# EAGLE schematic DiscoRap_V11 (EAGLE 6.6.0)

## Sheet 1 of 9
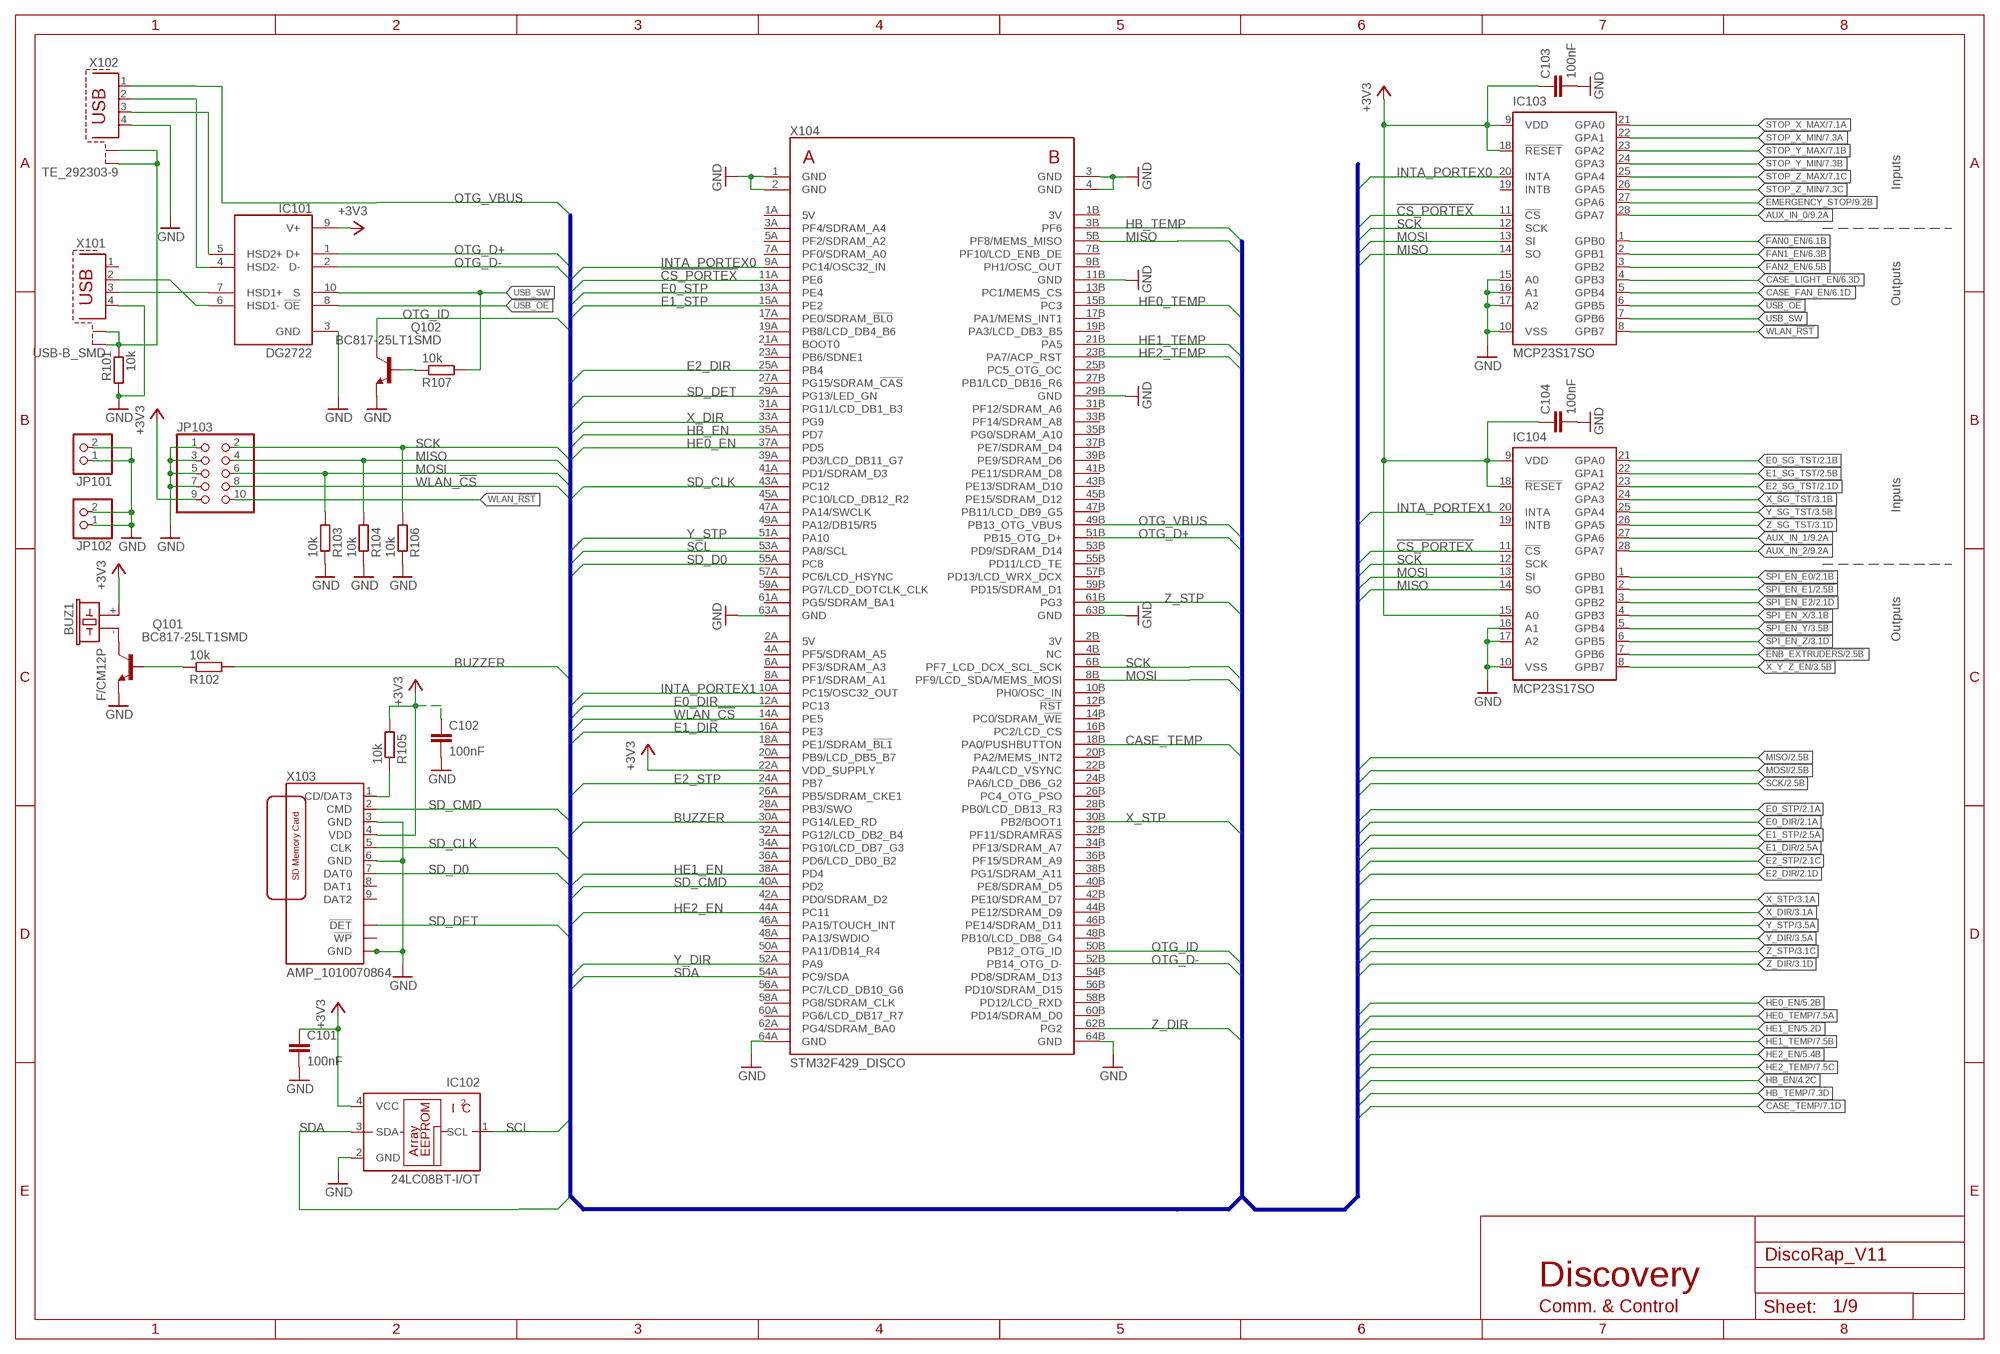
[diagram p0: schematic, sheet 1]

### Parts
BUZ1  F/CM12P  [F/CM12P]
C101  100nF  C-EU0805  [0805]
C102  100nF  C-EU0805  [0805]
C103  100nF  C-EU0805  [0805]
C104  100nF  C-EU0805  [0805]
IC101  DG2722  [MINI_QFN_10L]
IC102  24LC08BT-I/OT  24LC00OT  [SOT23-5L]
IC103  MCP23S17SO  [SO28W]
IC104  MCP23S17SO  [SO28W]
JP101  PINHD-1X2  [1X02]
JP102  PINHD-1X2  [1X02]
JP103  PINHD-2X5  [2X05]
Q101  BC817-25LT1SMD  [SOT23-BEC]
Q102  BC817-25LT1SMD  [SOT23-BEC]
R101  10k  R-EU0805  [0805]
R102  10k  R-EU0805  [0805]
R103  10k  R-EU0805  [0805]
R104  10k  R-EU0805  [0805]
R105  10k  R-EU0805  [0805]
R106  10k  R-EU0805  [0805]
R107  10k  R-EU0805  [0805]
X101  USB-B_SMD  [USB_B_SMD]
X102  TE_292303-9  [TE_USB_A_SMD]
X103  AMP_1010070864  [AMP_1010070864]
X104  STM32F429_DISCO  [STM429_DISCOVERY]

### Nets
!CS_PORTEX: IC103.11(!CS) IC104.11(!CS) X104.11A(PE6)
!ENB_EXTRUDERS: IC104.7(GPB6) ; also sheet 2
!SPI_EN_E0: IC104.1(GPB0) ; also sheet 2
!SPI_EN_E1: IC104.2(GPB1) ; also sheet 2
!SPI_EN_E2: IC104.3(GPB2) ; also sheet 2
!SPI_EN_X: IC104.4(GPB3) ; also sheet 3
!SPI_EN_Y: IC104.5(GPB4) ; also sheet 3
!SPI_EN_Z: IC104.6(GPB5) ; also sheet 3
!USB_OE: IC101.8(!OE) IC103.6(GPB5)
!X_Y_Z_EN: IC104.8(GPB7) ; also sheet 3
+3V3: BUZ1.+ C101.1 C102.1 C103.1 C104.1 IC101.9(V+) IC102.4(VCC) IC103.9(VDD) IC103.18(!RESET) IC104.9(VDD) IC104.15(A0) IC104.18(!RESET) JP103.9 R105.2 X103.4(VDD) X104.22A(VDD_SUPPLY) ; also sheet 2,3,7,8,9
AUX_IN_0: IC103.28(GPA7) ; also sheet 9
AUX_IN_1: IC104.27(GPA6) ; also sheet 9
AUX_IN_2: IC104.28(GPA7) ; also sheet 9
BUZZER: R102.2 X104.30A(PG14/LED_RD)
CASE_FAN_EN: IC103.5(GPB4) ; also sheet 6
CASE_LIGHT_EN: IC103.4(GPB3) ; also sheet 6
CASE_TEMP: X104.18B(PA0/PUSHBUTTON) ; also sheet 7
E0_DIR: X104.12A(PC13) ; also sheet 2
E0_SG_TST: IC104.21(GPA0) ; also sheet 2
E0_STP: X104.13A(PE4) ; also sheet 2
E1_DIR: X104.16A(PE3) ; also sheet 2
E1_SG_TST: IC104.22(GPA1) ; also sheet 2
E1_STP: X104.15A(PE2) ; also sheet 2
E2_DIR: X104.25A(PB4) ; also sheet 2
E2_SG_TST: IC104.23(GPA2) ; also sheet 2
E2_STP: X104.24A(PB7) ; also sheet 2
EMERGENCY_STOP: IC103.27(GPA6) ; also sheet 9
FAN0_EN: IC103.1(GPB0) ; also sheet 6
FAN1_EN: IC103.2(GPB1) ; also sheet 6
FAN2_EN: IC103.3(GPB2) ; also sheet 6
GND: C101.2 C102.2 C103.2 C104.2 IC101.3(GND) IC102.2(GND) IC103.10(VSS) IC103.15(A0) IC103.16(A1) IC103.17(A2) IC104.10(VSS) IC104.16(A1) IC104.17(A2) JP101.1 JP101.2 JP102.1 JP102.2 JP103.1 JP103.3 JP103.5 JP103.7 Q101.E Q102.E R101.2 R103.1 R104.1 R106.1 X101.4 X102.4 X103.3(GND) X103.6(GND) X103.GND1(GND) X103.GND2(GND) X103.GND3(GND) X103.GND4(GND) X104.1(GND) X104.2(GND) X104.3(GND) X104.4(GND) X104.11B(GND) X104.29B(GND) X104.63A(GND) X104.63B(GND) X104.64A(GND) X104.64B(GND) ; also sheet 2,3,4,5,6,7,8,9
HB_EN: X104.35A(PD7) ; also sheet 4
HB_TEMP: X104.3B(PF6) ; also sheet 7
HE0_EN: X104.37A(PD5) ; also sheet 5
HE0_TEMP: X104.15B(PC3) ; also sheet 7
HE1_EN: X104.38A(PD4) ; also sheet 5
HE1_TEMP: X104.21B(PA5) ; also sheet 7
HE2_EN: X104.44A(PC11) ; also sheet 5
HE2_TEMP: X104.23B(PA7/ACP_RST) ; also sheet 7
INTA_PORTEX0: IC103.20(INTA) X104.9A(PC14/OSC32_IN)
INTA_PORTEX1: IC104.20(INTA) X104.10A(PC15/OSC32_OUT)
MISO: IC103.14(SO) IC104.14(SO) JP103.4 R104.2 X104.5B(PF8/MEMS_MISO) ; also sheet 2,3,9
MOSI: IC103.13(SI) IC104.13(SI) JP103.6 R103.2 X104.8B(PF9/LCD_SDA/MEMS_MOSI) ; also sheet 2,3,9
N$1: R105.1 X103.1(CD/DAT3)
N$2: IC101.4(HSD2-) X102.2
N$37: IC101.5(HSD2+) X102.3
N$38: IC101.7(HSD1+) X101.3
N$39: BUZ1.- Q101.C
N$40: IC101.6(HSD1-) X101.2
N$41: R101.1 X101.5(S1) X101.6(S2) X102.5(S1) X102.6(S2)
N$43: Q102.B R107.1
N$89: Q101.B R102.1
OTG_D+: IC101.1(D+) X104.51B(PB15_OTG_D+)
OTG_D-: IC101.2(D-) X104.52B(PB14_OTG_D-)
OTG_ID: Q102.C X104.50B(PB12_OTG_ID)
OTG_VBUS: X102.1 X104.49B(PB13_OTG_VBUS)
SCK: IC103.12(SCK) IC104.12(SCK) JP103.2 R106.2 X104.6B(PF7_LCD_DCX_SCL_SCK) ; also sheet 2,3,9
SCL: IC102.1(SCL) X104.53A(PA8/SCL)
SD_CLK: X103.5(CLK) X104.43A(PC12)
SD_CMD: X103.2(CMD) X104.40A(PD2)
SD_D0: X103.7(DAT0) X104.55A(PC8)
SD_DET: X103.DET(!DET) X104.29A(PG13/LED_GN)
SDA: IC102.3(SDA) X104.54A(PC9/SDA)
STOP_X_MAX: IC103.21(GPA0) ; also sheet 7
STOP_X_MIN: IC103.22(GPA1) ; also sheet 7
STOP_Y_MAX: IC103.23(GPA2) ; also sheet 7
STOP_Y_MIN: IC103.24(GPA3) ; also sheet 7
STOP_Z_MAX: IC103.25(GPA4) ; also sheet 7
STOP_Z_MIN: IC103.26(GPA5) ; also sheet 7
USB_SW: IC101.10(S) IC103.7(GPB6) R107.2
WLAN_!CS: JP103.8 X104.14A(PE5)
WLAN_!RST: IC103.8(GPB7) JP103.10
X_DIR: X104.33A(PG9) ; also sheet 3
X_SG_TST: IC104.24(GPA3) ; also sheet 3
X_STP: X104.30B(PB2/BOOT1) ; also sheet 3
Y_DIR: X104.52A(PA9) ; also sheet 3
Y_SG_TST: IC104.25(GPA4) ; also sheet 3
Y_STP: X104.51A(PA10) ; also sheet 3
Z_DIR: X104.62B(PG2) ; also sheet 3
Z_SG_TST: IC104.26(GPA5) ; also sheet 3
Z_STP: X104.61B(PG3) ; also sheet 3
Unconnected: IC103.19(INTB) IC104.19(INTB) X101.1 X103.8(DAT1) X103.9(DAT2) X103.WP(!WP) X104.1A(5V) X104.1B(3V) X104.2A(5V) X104.2B(3V) X104.3A(PF4/SDRAM_A4) X104.4A(PF5/SDRAM_A5) X104.4B(NC) X104.5A(PF2/SDRAM_A2) X104.6A(PF3/SDRAM_A3) X104.7A(PF0/SDRAM_A0) X104.7B(PF10/LCD_ENB_DE) X104.8A(PF1/SDRAM_A1) X104.9B(PH1/OSC_OUT) X104.10B(PH0/OSC_IN) X104.12B(!RST) X104.13B(PC1/MEMS_CS) X104.14B(PC0/SDRAM_!WE) X104.16B(PC2/LCD_CS) X104.17A(PE0/SDRAM_!BL0) X104.17B(PA1/MEMS_INT1) X104.18A(PE1/SDRAM_!BL1) X104.19A(PB8/LCD_DB4_B6) X104.19B(PA3/LCD_DB3_B5) X104.20A(PB9/LCD_DB5_B7) X104.20B(PA2/MEMS_INT2) X104.21A(BOOT0) X104.22B(PA4/LCD_VSYNC) X104.23A(PB6/SDNE1) X104.24B(PA6/LCD_DB6_G2) X104.25B(PC5_OTG_OC) X104.26A(PB5/SDRAM_CKE1) X104.26B(PC4_OTG_PSO) X104.27A(PG15/SDRAM_!CAS) X104.27B(PB1/LCD_DB16_R6) X104.28A(PB3/SWO) X104.28B(PB0/LCD_DB13_R3) X104.31A(PG11/LCD_DB1_B3) X104.31B(PF12/SDRAM_A6) X104.32A(PG12/LCD_DB2_B4) X104.32B(PF11/SDRAM!RAS) X104.33B(PF14/SDRAM_A8) X104.34A(PG10/LCD_DB7_G3) X104.34B(PF13/SDRAM_A7) X104.35B(PG0/SDRAM_A10) X104.36A(PD6/LCD_DB0_B2) X104.36B(PF15/SDRAM_A9) X104.37B(PE7/SDRAM_D4) X104.38B(PG1/SDRAM_A11) X104.39A(PD3/LCD_DB11_G7) X104.39B(PE9/SDRAM_D6) X104.40B(PE8/SDRAM_D5) X104.41A(PD1/SDRAM_D3) X104.41B(PE11/SDRAM_D8) X104.42A(PD0/SDRAM_D2) X104.42B(PE10/SDRAM_D7) X104.43B(PE13/SDRAM_D10) X104.44B(PE12/SDRAM_D9) X104.45A(PC10/LCD_DB12_R2) X104.45B(PE15/SDRAM_D12) X104.46A(PA15/TOUCH_INT) X104.46B(PE14/SDRAM_D11) X104.47A(PA14/SWCLK) X104.47B(PB11/LCD_DB9_G5) X104.48A(PA13/SWDIO) X104.48B(PB10/LCD_DB8_G4) X104.49A(PA12/DB15/R5) X104.50A(PA11/DB14_R4) X104.53B(PD9/SDRAM_D14) X104.54B(PD8/SDRAM_D13) X104.55B(PD11/LCD_TE) X104.56A(PC7/LCD_DB10_G6) X104.56B(PD10/SDRAM_D15) X104.57A(PC6/LCD_HSYNC) X104.57B(PD13/LCD_WRX_DCX) X104.58A(PG8/SDRAM_CLK) X104.58B(PD12/LCD_RXD) X104.59A(PG7/LCD_DOTCLK_CLK) X104.59B(PD15/SDRAM_D1) X104.60A(PG6/LCD_DB17_R7) X104.60B(PD14/SDRAM_D0) X104.61A(PG5/SDRAM_BA1) X104.62A(PG4/SDRAM_BA0)

### Buses
MOSI,MISO,SCK,!CS_PORTEX,INTA_PORTEX0,INTA_PORTEX1,SDA,SCL,E0_STP,E0_DIR,E1_STP,E1_DIR,E2_STP,E2_DIR,X_STP,X_DIR,Y_STP,Y_DIR,Z_STP,Z_DIR,SD_D0,SD_CLK,SD_CMD,SD_DET,WLAN_!CS,HE0_EN,HE0_TEMP,HE1_EN,HE1_TEMP,HE2_EN,HE2_TEMP,HB_EN,HB_TEMP,CASE_TEMP,OTG_VBUS,OTG_D+,OTG_D-,OTG_ID,BUZZER

### Notes on the sheet
- Inputs
- Outputs
- Inputs
- Outputs
- Discovery
- Comm. & Control

## Sheet 2 of 9
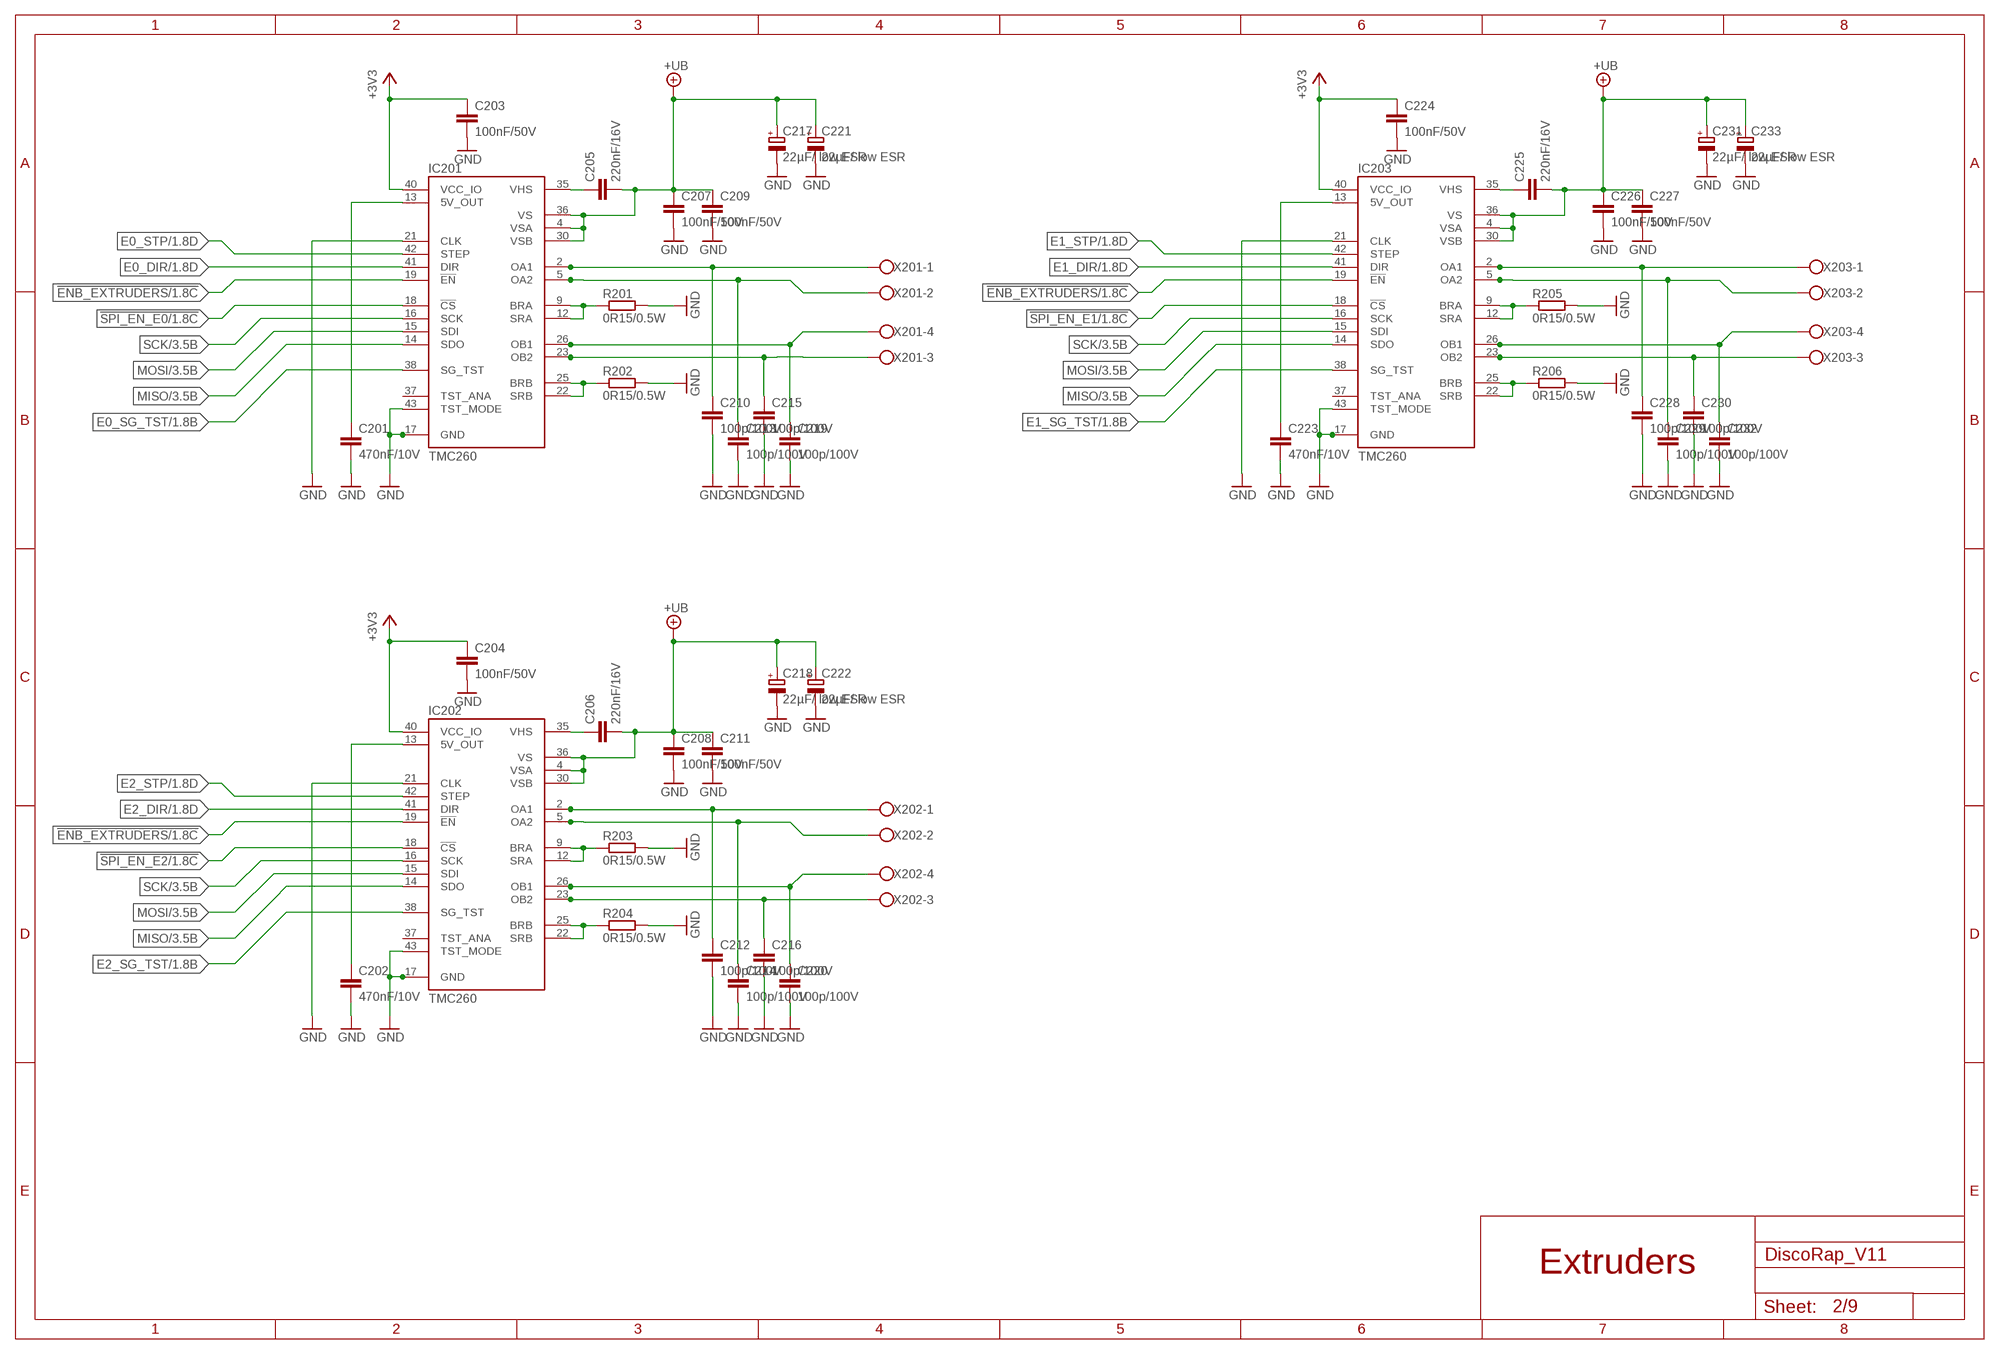
[diagram p1: schematic, sheet 2]

### Parts
C201  470nF/10V  C-EU0805  [0805]
C202  470nF/10V  C-EU0805  [0805]
C203  100nF/50V  C-EU0805  [0805]
C204  100nF/50V  C-EU0805  [0805]
C205  220nF/16V  C-EU0805  [0805]
C206  220nF/16V  C-EU0805  [0805]
C207  100nF/50V  C-EU0805  [0805]
C208  100nF/50V  C-EU0805  [0805]
C209  100nF/50V  C-EU0805  [0805]
C210  100p/100V  C-EU0805  [0805]
C211  100nF/50V  C-EU0805  [0805]
C212  100p/100V  C-EU0805  [0805]
C213  100p/100V  C-EU0805  [0805]
C214  100p/100V  C-EU0805  [0805]
C215  100p/100V  C-EU0805  [0805]
C216  100p/100V  C-EU0805  [0805]
C217  22µF/ low ESR  CPOL-EUSANYO_SMD_B6  [SANYO-OSCON_SMD_B6]
C218  22µF/ low ESR  CPOL-EUSANYO_SMD_B6  [SANYO-OSCON_SMD_B6]
C219  100p/100V  C-EU0805  [0805]
C220  100p/100V  C-EU0805  [0805]
C221  22µF/ low ESR  CPOL-EUSANYO_SMD_B6  [SANYO-OSCON_SMD_B6]
C222  22µF/ low ESR  CPOL-EUSANYO_SMD_B6  [SANYO-OSCON_SMD_B6]
C223  470nF/10V  C-EU0805  [0805]
C224  100nF/50V  C-EU0805  [0805]
C225  220nF/16V  C-EU0805  [0805]
C226  100nF/50V  C-EU0805  [0805]
C227  100nF/50V  C-EU0805  [0805]
C228  100p/100V  C-EU0805  [0805]
C229  100p/100V  C-EU0805  [0805]
C230  100p/100V  C-EU0805  [0805]
C231  22µF/ low ESR  CPOL-EUSANYO_SMD_B6  [SANYO-OSCON_SMD_B6]
C232  100p/100V  C-EU0805  [0805]
C233  22µF/ low ESR  CPOL-EUSANYO_SMD_B6  [SANYO-OSCON_SMD_B6]
IC201  TMC260  [SQFP-S-10X10-44]
IC202  TMC260  [SQFP-S-10X10-44]
IC203  TMC260  [SQFP-S-10X10-44]
R201  0R15/0.5W  R-EU_R1206  [R1206]
R202  0R15/0.5W  R-EU_R1206  [R1206]
R203  0R15/0.5W  R-EU_R1206  [R1206]
R204  0R15/0.5W  R-EU_R1206  [R1206]
R205  0R15/0.5W  R-EU_R1206  [R1206]
R206  0R15/0.5W  R-EU_R1206  [R1206]
X201  W237-4  [W237-4]
X202  W237-4  [W237-4]
X203  W237-4  [W237-4]

### Nets
!ENB_EXTRUDERS: IC201.19(!EN) IC202.19(!EN) IC203.19(!EN) ; also sheet 1
!SPI_EN_E0: IC201.18(!CS) ; also sheet 1
!SPI_EN_E1: IC203.18(!CS) ; also sheet 1
!SPI_EN_E2: IC202.18(!CS) ; also sheet 1
+3V3: C203.1 C204.1 C224.1 IC201.40(VCC_IO) IC202.40(VCC_IO) IC203.40(VCC_IO) ; also sheet 1,3,7,8,9
+UB: C205.2 C206.2 C207.1 C208.1 C209.1 C211.1 C217.+ C218.+ C221.+ C222.+ C225.2 C226.1 C227.1 C231.+ C233.+ IC201.4(VSA) IC201.30(VSB) IC201.36(VS) IC202.4(VSA) IC202.30(VSB) IC202.36(VS) IC203.4(VSA) IC203.30(VSB) IC203.36(VS) ; also sheet 3,4,5,8
E0_A1: C210.1 IC201.2(OA1) IC201.3(OA1) IC201.7(OA1) IC201.8(OA1) X201.1
E0_A2: C213.1 IC201.5(OA2) IC201.6(OA2) IC201.10(OA2) IC201.11(OA2) X201.2
E0_A3: C229.1 IC203.5(OA2) IC203.6(OA2) IC203.10(OA2) IC203.11(OA2) X203.2
E0_A4: C228.1 IC203.2(OA1) IC203.3(OA1) IC203.7(OA1) IC203.8(OA1) X203.1
E0_A5: C214.1 IC202.5(OA2) IC202.6(OA2) IC202.10(OA2) IC202.11(OA2) X202.2
E0_A6: C212.1 IC202.2(OA1) IC202.3(OA1) IC202.7(OA1) IC202.8(OA1) X202.1
E0_B1: C219.1 IC201.26(OB1) IC201.27(OB1) IC201.31(OB1) IC201.32(OB1) X201.4
E0_B2: C215.1 IC201.23(OB2) IC201.24(OB2) IC201.28(OB2) IC201.29(OB2) X201.3
E0_B3: C232.1 IC203.26(OB1) IC203.27(OB1) IC203.31(OB1) IC203.32(OB1) X203.4
E0_B4: C230.1 IC203.23(OB2) IC203.24(OB2) IC203.28(OB2) IC203.29(OB2) X203.3
E0_B5: C220.1 IC202.26(OB1) IC202.27(OB1) IC202.31(OB1) IC202.32(OB1) X202.4
E0_B6: C216.1 IC202.23(OB2) IC202.24(OB2) IC202.28(OB2) IC202.29(OB2) X202.3
E0_DIR: IC201.41(DIR) ; also sheet 1
E0_SG_TST: IC201.38(SG_TST) ; also sheet 1
E0_STP: IC201.42(STEP) ; also sheet 1
E1_DIR: IC203.41(DIR) ; also sheet 1
E1_SG_TST: IC203.38(SG_TST) ; also sheet 1
E1_STP: IC203.42(STEP) ; also sheet 1
E2_DIR: IC202.41(DIR) ; also sheet 1
E2_SG_TST: IC202.38(SG_TST) ; also sheet 1
E2_STP: IC202.42(STEP) ; also sheet 1
GND: C201.2 C202.2 C203.2 C204.2 C207.2 C208.2 C209.2 C210.2 C211.2 C212.2 C213.2 C214.2 C215.2 C216.2 C217.- C218.- C219.2 C220.2 C221.- C222.- C223.2 C224.2 C226.2 C227.2 C228.2 C229.2 C230.2 C231.- C232.2 C233.- IC201.17(GND) IC201.21(CLK) IC201.39(GND) IC201.43(TST_MODE) IC201.44(GND) IC202.17(GND) IC202.21(CLK) IC202.39(GND) IC202.43(TST_MODE) IC202.44(GND) IC203.17(GND) IC203.21(CLK) IC203.39(GND) IC203.43(TST_MODE) IC203.44(GND) R201.2 R202.2 R203.2 R204.2 R205.2 R206.2 ; also sheet 1,3,4,5,6,7,8,9
MISO: IC201.14(SDO) IC202.14(SDO) IC203.14(SDO) ; also sheet 1,3,9
MOSI: IC201.15(SDI) IC202.15(SDI) IC203.15(SDI) ; also sheet 1,3,9
N$13: C205.1 IC201.35(VHS)
N$14: IC201.9(BRA) IC201.12(SRA) R201.1
N$15: IC201.22(SRB) IC201.25(BRB) R202.1
N$16: C201.1 IC201.13(5V_OUT)
N$17: C225.1 IC203.35(VHS)
N$18: IC203.9(BRA) IC203.12(SRA) R205.1
N$19: IC203.22(SRB) IC203.25(BRB) R206.1
N$20: C223.1 IC203.13(5V_OUT)
N$21: C206.1 IC202.35(VHS)
N$22: IC202.9(BRA) IC202.12(SRA) R203.1
N$23: IC202.22(SRB) IC202.25(BRB) R204.1
N$24: C202.1 IC202.13(5V_OUT)
SCK: IC201.16(SCK) IC202.16(SCK) IC203.16(SCK) ; also sheet 1,3,9
Unconnected: IC201.37(TST_ANA) IC202.37(TST_ANA) IC203.37(TST_ANA)

### Notes on the sheet
- Extruders

## Sheet 3 of 9
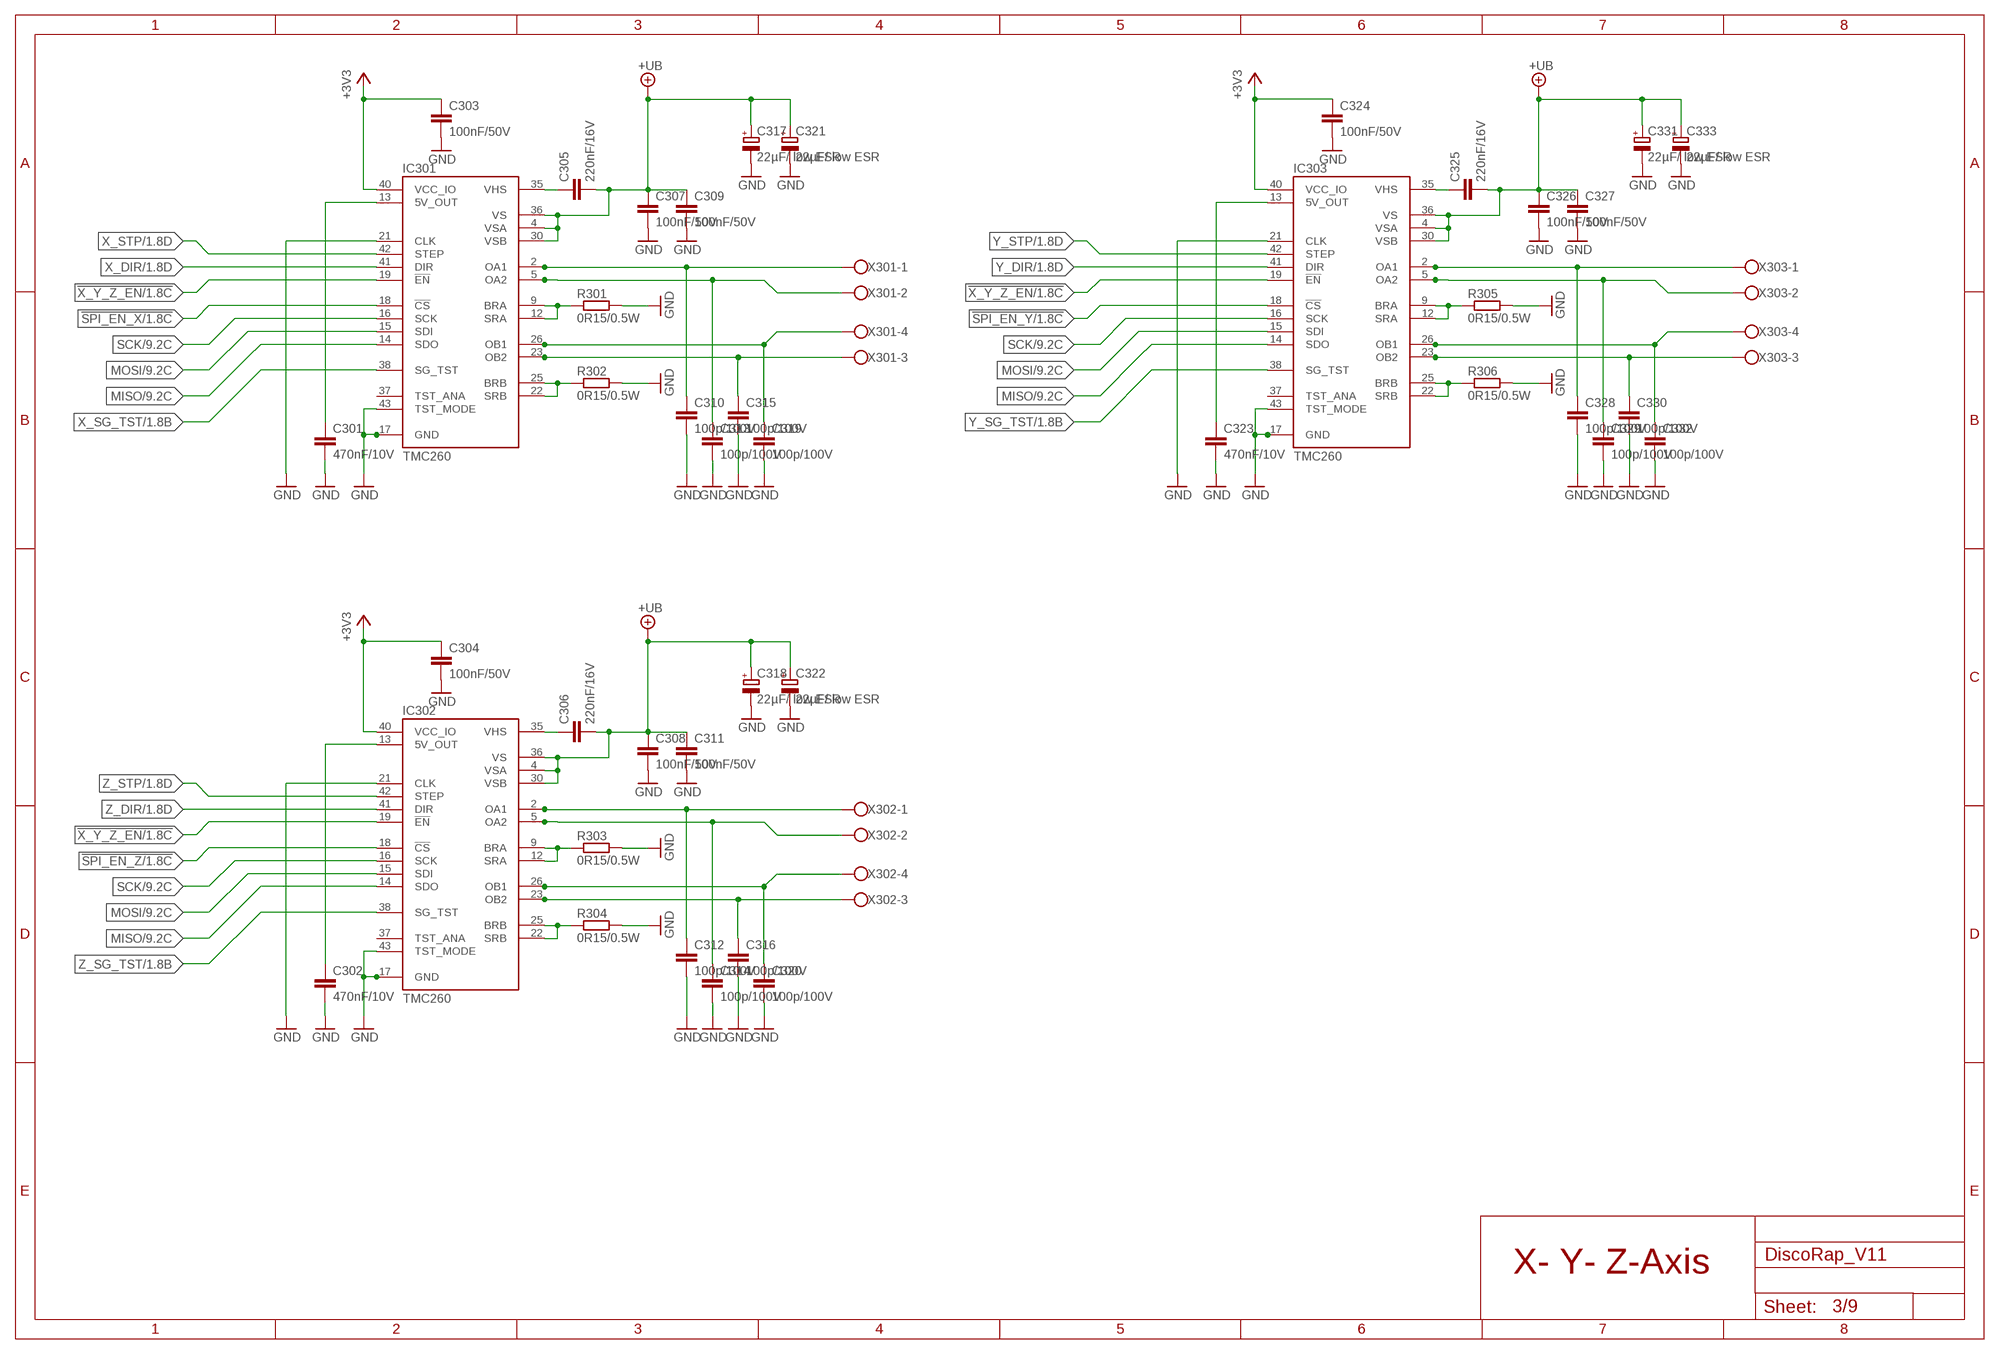
[diagram p2: schematic, sheet 3]

### Parts
C301  470nF/10V  C-EU0805  [0805]
C302  470nF/10V  C-EU0805  [0805]
C303  100nF/50V  C-EU0805  [0805]
C304  100nF/50V  C-EU0805  [0805]
C305  220nF/16V  C-EU0805  [0805]
C306  220nF/16V  C-EU0805  [0805]
C307  100nF/50V  C-EU0805  [0805]
C308  100nF/50V  C-EU0805  [0805]
C309  100nF/50V  C-EU0805  [0805]
C310  100p/100V  C-EU0805  [0805]
C311  100nF/50V  C-EU0805  [0805]
C312  100p/100V  C-EU0805  [0805]
C313  100p/100V  C-EU0805  [0805]
C314  100p/100V  C-EU0805  [0805]
C315  100p/100V  C-EU0805  [0805]
C316  100p/100V  C-EU0805  [0805]
C317  22µF/ low ESR  CPOL-EUSANYO_SMD_B6  [SANYO-OSCON_SMD_B6]
C318  22µF/ low ESR  CPOL-EUSANYO_SMD_B6  [SANYO-OSCON_SMD_B6]
C319  100p/100V  C-EU0805  [0805]
C320  100p/100V  C-EU0805  [0805]
C321  22µF/ low ESR  CPOL-EUSANYO_SMD_B6  [SANYO-OSCON_SMD_B6]
C322  22µF/ low ESR  CPOL-EUSANYO_SMD_B6  [SANYO-OSCON_SMD_B6]
C323  470nF/10V  C-EU0805  [0805]
C324  100nF/50V  C-EU0805  [0805]
C325  220nF/16V  C-EU0805  [0805]
C326  100nF/50V  C-EU0805  [0805]
C327  100nF/50V  C-EU0805  [0805]
C328  100p/100V  C-EU0805  [0805]
C329  100p/100V  C-EU0805  [0805]
C330  100p/100V  C-EU0805  [0805]
C331  22µF/ low ESR  CPOL-EUSANYO_SMD_B6  [SANYO-OSCON_SMD_B6]
C332  100p/100V  C-EU0805  [0805]
C333  22µF/ low ESR  CPOL-EUSANYO_SMD_B6  [SANYO-OSCON_SMD_B6]
IC301  TMC260  [SQFP-S-10X10-44]
IC302  TMC260  [SQFP-S-10X10-44]
IC303  TMC260  [SQFP-S-10X10-44]
R301  0R15/0.5W  R-EU_R1206  [R1206]
R302  0R15/0.5W  R-EU_R1206  [R1206]
R303  0R15/0.5W  R-EU_R1206  [R1206]
R304  0R15/0.5W  R-EU_R1206  [R1206]
R305  0R15/0.5W  R-EU_R1206  [R1206]
R306  0R15/0.5W  R-EU_R1206  [R1206]
X301  W237-4  [W237-4]
X302  W237-4  [W237-4]
X303  W237-4  [W237-4]

### Nets
!SPI_EN_X: IC301.18(!CS) ; also sheet 1
!SPI_EN_Y: IC303.18(!CS) ; also sheet 1
!SPI_EN_Z: IC302.18(!CS) ; also sheet 1
!X_Y_Z_EN: IC301.19(!EN) IC302.19(!EN) IC303.19(!EN) ; also sheet 1
+3V3: C303.1 C304.1 C324.1 IC301.40(VCC_IO) IC302.40(VCC_IO) IC303.40(VCC_IO) ; also sheet 1,2,7,8,9
+UB: C305.2 C306.2 C307.1 C308.1 C309.1 C311.1 C317.+ C318.+ C321.+ C322.+ C325.2 C326.1 C327.1 C331.+ C333.+ IC301.4(VSA) IC301.30(VSB) IC301.36(VS) IC302.4(VSA) IC302.30(VSB) IC302.36(VS) IC303.4(VSA) IC303.30(VSB) IC303.36(VS) ; also sheet 2,4,5,8
E0_A7: C313.1 IC301.5(OA2) IC301.6(OA2) IC301.10(OA2) IC301.11(OA2) X301.2
E0_A8: C310.1 IC301.2(OA1) IC301.3(OA1) IC301.7(OA1) IC301.8(OA1) X301.1
E0_A9: C329.1 IC303.5(OA2) IC303.6(OA2) IC303.10(OA2) IC303.11(OA2) X303.2
E0_A10: C328.1 IC303.2(OA1) IC303.3(OA1) IC303.7(OA1) IC303.8(OA1) X303.1
E0_A11: C314.1 IC302.5(OA2) IC302.6(OA2) IC302.10(OA2) IC302.11(OA2) X302.2
E0_A12: C312.1 IC302.2(OA1) IC302.3(OA1) IC302.7(OA1) IC302.8(OA1) X302.1
E0_B7: C319.1 IC301.26(OB1) IC301.27(OB1) IC301.31(OB1) IC301.32(OB1) X301.4
E0_B8: C315.1 IC301.23(OB2) IC301.24(OB2) IC301.28(OB2) IC301.29(OB2) X301.3
E0_B9: C332.1 IC303.26(OB1) IC303.27(OB1) IC303.31(OB1) IC303.32(OB1) X303.4
E0_B10: C330.1 IC303.23(OB2) IC303.24(OB2) IC303.28(OB2) IC303.29(OB2) X303.3
E0_B11: C320.1 IC302.26(OB1) IC302.27(OB1) IC302.31(OB1) IC302.32(OB1) X302.4
E0_B12: C316.1 IC302.23(OB2) IC302.24(OB2) IC302.28(OB2) IC302.29(OB2) X302.3
GND: C301.2 C302.2 C303.2 C304.2 C307.2 C308.2 C309.2 C310.2 C311.2 C312.2 C313.2 C314.2 C315.2 C316.2 C317.- C318.- C319.2 C320.2 C321.- C322.- C323.2 C324.2 C326.2 C327.2 C328.2 C329.2 C330.2 C331.- C332.2 C333.- IC301.17(GND) IC301.21(CLK) IC301.39(GND) IC301.43(TST_MODE) IC301.44(GND) IC302.17(GND) IC302.21(CLK) IC302.39(GND) IC302.43(TST_MODE) IC302.44(GND) IC303.17(GND) IC303.21(CLK) IC303.39(GND) IC303.43(TST_MODE) IC303.44(GND) R301.2 R302.2 R303.2 R304.2 R305.2 R306.2 ; also sheet 1,2,4,5,6,7,8,9
MISO: IC301.14(SDO) IC302.14(SDO) IC303.14(SDO) ; also sheet 1,2,9
MOSI: IC301.15(SDI) IC302.15(SDI) IC303.15(SDI) ; also sheet 1,2,9
N$25: C305.1 IC301.35(VHS)
N$26: IC301.9(BRA) IC301.12(SRA) R301.1
N$27: IC301.22(SRB) IC301.25(BRB) R302.1
N$28: C301.1 IC301.13(5V_OUT)
N$29: C325.1 IC303.35(VHS)
N$30: IC303.9(BRA) IC303.12(SRA) R305.1
N$31: IC303.22(SRB) IC303.25(BRB) R306.1
N$32: C323.1 IC303.13(5V_OUT)
N$33: C306.1 IC302.35(VHS)
N$34: IC302.9(BRA) IC302.12(SRA) R303.1
N$35: IC302.22(SRB) IC302.25(BRB) R304.1
N$36: C302.1 IC302.13(5V_OUT)
SCK: IC301.16(SCK) IC302.16(SCK) IC303.16(SCK) ; also sheet 1,2,9
X_DIR: IC301.41(DIR) ; also sheet 1
X_SG_TST: IC301.38(SG_TST) ; also sheet 1
X_STP: IC301.42(STEP) ; also sheet 1
Y_DIR: IC303.41(DIR) ; also sheet 1
Y_SG_TST: IC303.38(SG_TST) ; also sheet 1
Y_STP: IC303.42(STEP) ; also sheet 1
Z_DIR: IC302.41(DIR) ; also sheet 1
Z_SG_TST: IC302.38(SG_TST) ; also sheet 1
Z_STP: IC302.42(STEP) ; also sheet 1
Unconnected: IC301.37(TST_ANA) IC302.37(TST_ANA) IC303.37(TST_ANA)

### Notes on the sheet
- X- Y- Z-Axis

## Sheet 4 of 9
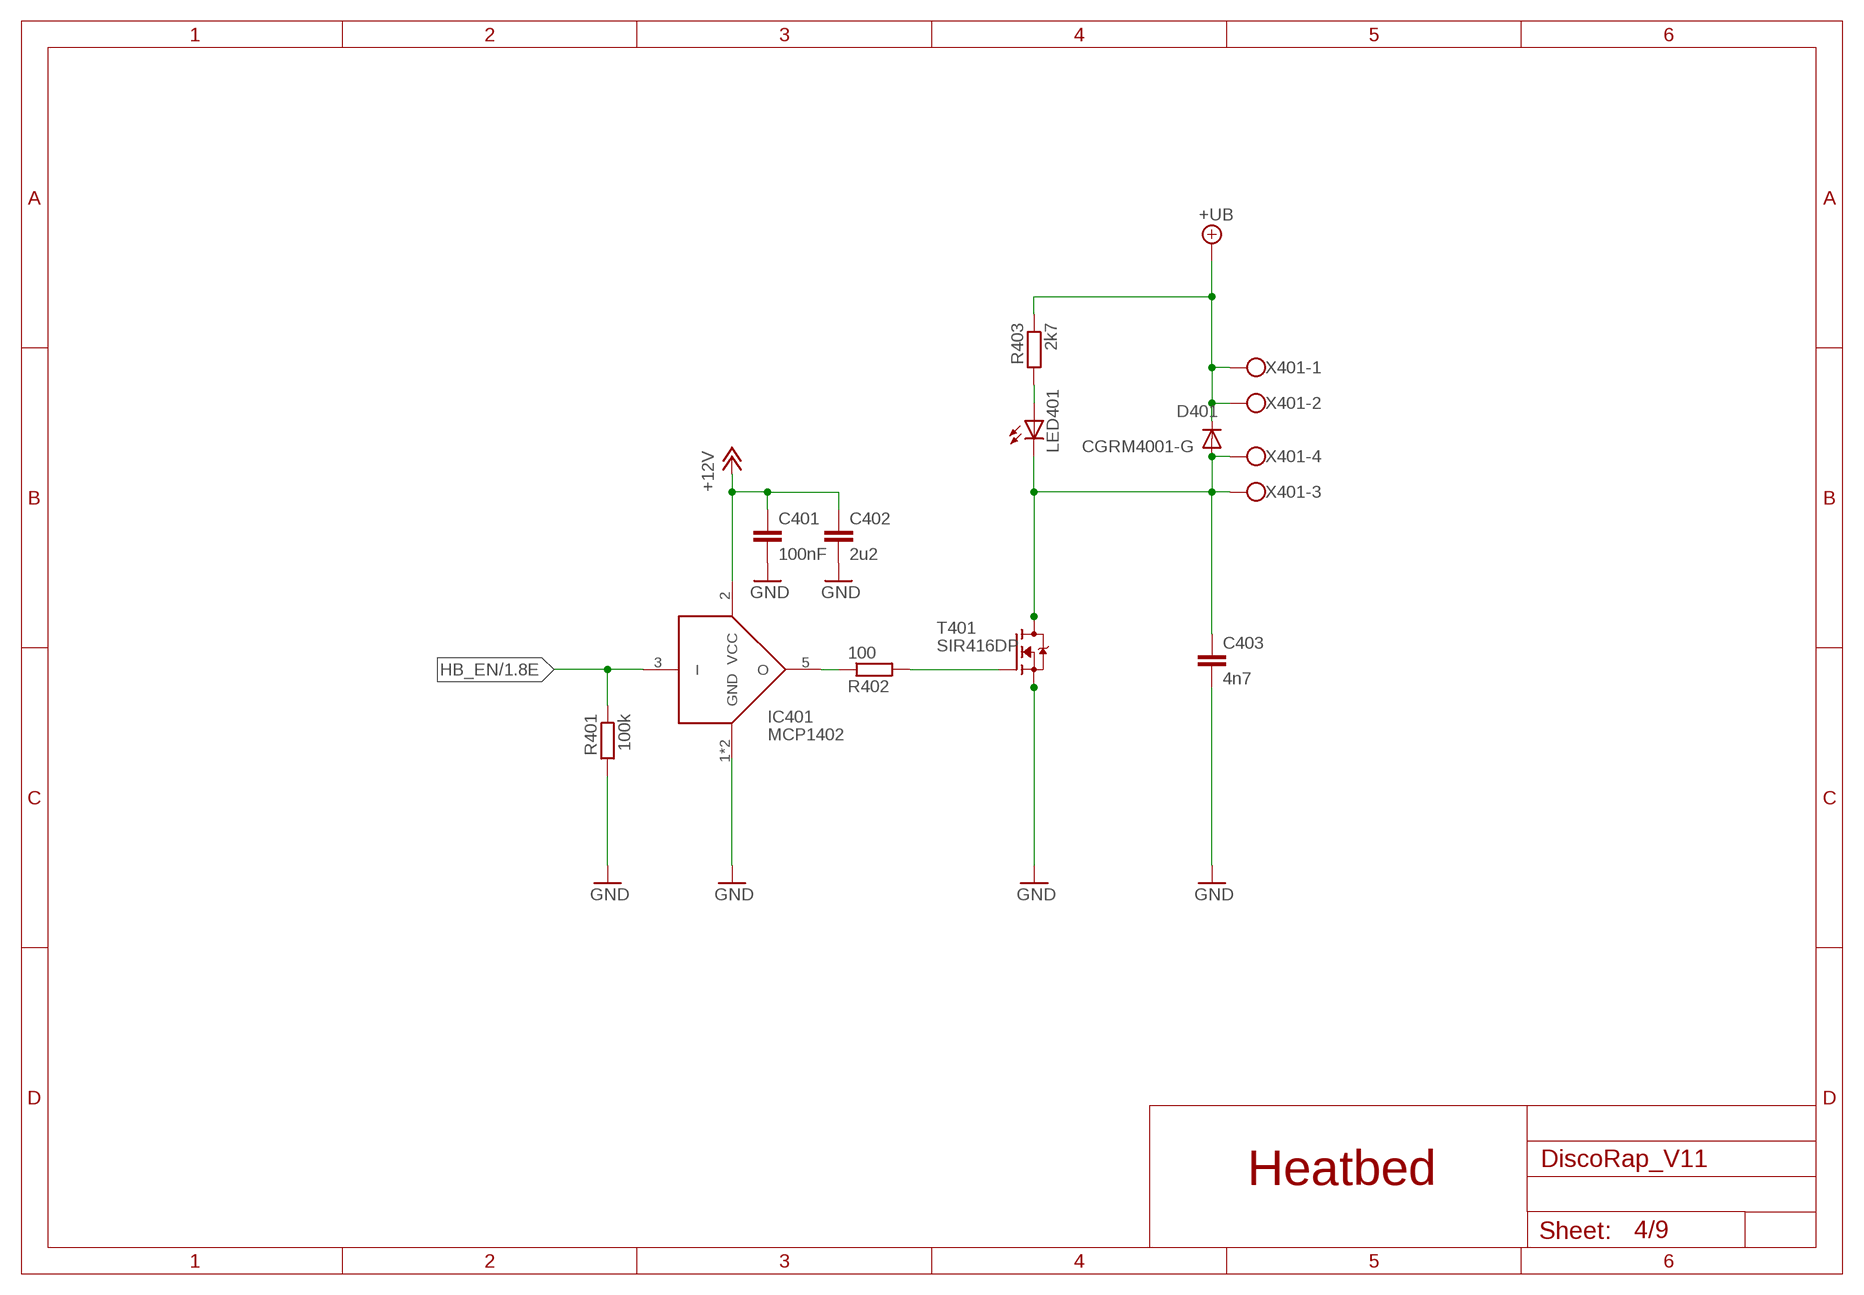
[diagram p3: schematic, sheet 4]

### Parts
C401  100nF  C-EU0805  [0805]
C402  2u2  C-EU0805  [0805]
C403  4n7  C-EU0805  [0805]
D401  CGRM4001-G  [SOD-123_MINI-SMA]
IC401  MCP1402  [SOT23-5L]
LED401  LEDCHIPLED_0805  [CHIPLED_0805]
R401  100k  R-EU0805  [0805]
R402  100  R-EU0805  [0805]
R403  2k7  R-EU0805  [0805]
T401  SIR416DP  [SO-8_POWERPACK]
X401  W237-4  [W237-4]

### Nets
+12V: C401.1 C402.1 IC401.2(VCC) ; also sheet 6,8
+UB: D401.C R403.1 X401.1 X401.2 ; also sheet 2,3,5,8
GND: C401.2 C402.2 C403.2 IC401.1(GND) IC401.4(GND) R401.2 T401.1(S) T401.2(S) T401.3(S) ; also sheet 1,2,3,5,6,7,8,9
HB_EN: IC401.3(I) R401.1 ; also sheet 1
N$6: R402.2 T401.4(G)
N$42: IC401.5(O) R402.1
N$44: C403.1 D401.A LED401.C T401.5(D) T401.6(D) T401.7(D) T401.8(D) T401.EXP_PAD(D) X401.3 X401.4
N$48: LED401.A R403.2

### Notes on the sheet
- Heatbed

## Sheet 5 of 9
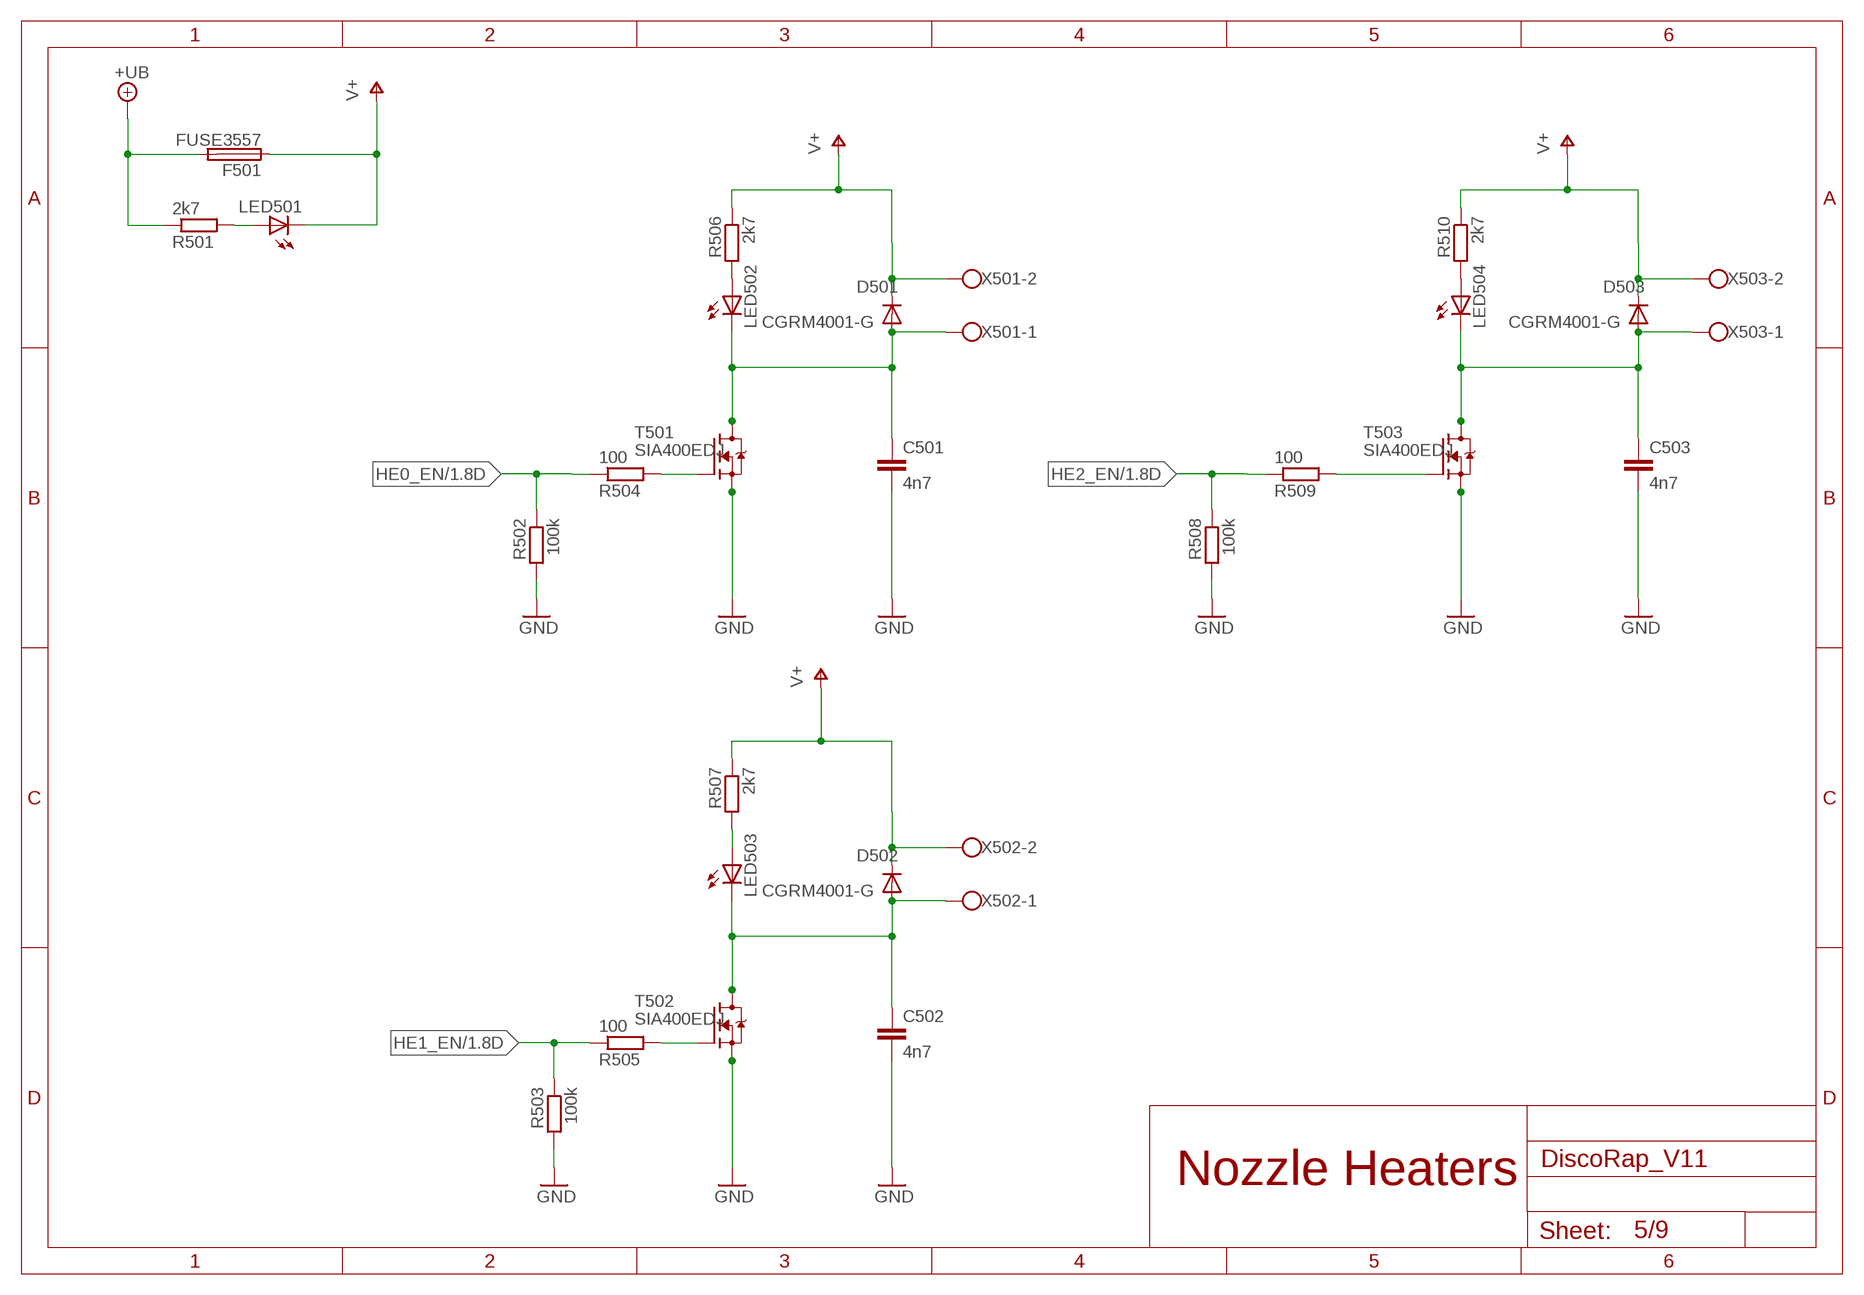
[diagram p4: schematic, sheet 5]

### Parts
C501  4n7  C-EU0805  [0805]
C502  4n7  C-EU0805  [0805]
C503  4n7  C-EU0805  [0805]
D501  CGRM4001-G  [SOD-123_MINI-SMA]
D502  CGRM4001-G  [SOD-123_MINI-SMA]
D503  CGRM4001-G  [SOD-123_MINI-SMA]
F501  FUSE3557  [3557]
LED501  LEDCHIPLED_0805  [CHIPLED_0805]
LED502  LEDCHIPLED_0805  [CHIPLED_0805]
LED503  LEDCHIPLED_0805  [CHIPLED_0805]
LED504  LEDCHIPLED_0805  [CHIPLED_0805]
R501  2k7  R-EU0805  [0805]
R502  100k  R-EU0805  [0805]
R503  100k  R-EU0805  [0805]
R504  100  R-EU0805  [0805]
R505  100  R-EU0805  [0805]
R506  2k7  R-EU0805  [0805]
R507  2k7  R-EU0805  [0805]
R508  100k  R-EU0805  [0805]
R509  100  R-EU0805  [0805]
R510  2k7  R-EU0805  [0805]
T501  SIA400EDJ  [SC70-6L]
T502  SIA400EDJ  [SC70-6L]
T503  SIA400EDJ  [SC70-6L]
X501  W237-102  [W237-102]
X502  W237-102  [W237-102]
X503  W237-102  [W237-102]

### Nets
+UB: F501.3 F501.4 R501.1 ; also sheet 2,3,4,8
GND: C501.2 C502.2 C503.2 R502.2 R503.2 R508.2 T501.4(S) T501.EXP_SOURCE(S) T502.4(S) T502.EXP_SOURCE(S) T503.4(S) T503.EXP_SOURCE(S) ; also sheet 1,2,3,4,6,7,8,9
HE0_EN: R502.1 R504.1 ; also sheet 1
HE1_EN: R503.1 R505.1 ; also sheet 1
HE2_EN: R508.1 R509.1 ; also sheet 1
N$49: R504.2 T501.3(G)
N$50: C501.1 D501.A LED502.C T501.1(D) T501.2(D) T501.5(D) T501.6(D) T501.EXP_DRAIN(D) X501.1
N$51: LED502.A R506.2
N$52: R505.2 T502.3(G)
N$53: C502.1 D502.A LED503.C T502.1(D) T502.2(D) T502.5(D) T502.6(D) T502.EXP_DRAIN(D) X502.1
N$54: LED503.A R507.2
N$55: R509.2 T503.3(G)
N$56: C503.1 D503.A LED504.C T503.1(D) T503.2(D) T503.5(D) T503.6(D) T503.EXP_DRAIN(D) X503.1
N$57: LED504.A R510.2
N$88: LED501.A R501.2
V+: D501.C D502.C D503.C F501.1 F501.2 LED501.C R506.1 R507.1 R510.1 X501.2 X502.2 X503.2

### Notes on the sheet
- Nozzle Heaters

## Sheet 6 of 9
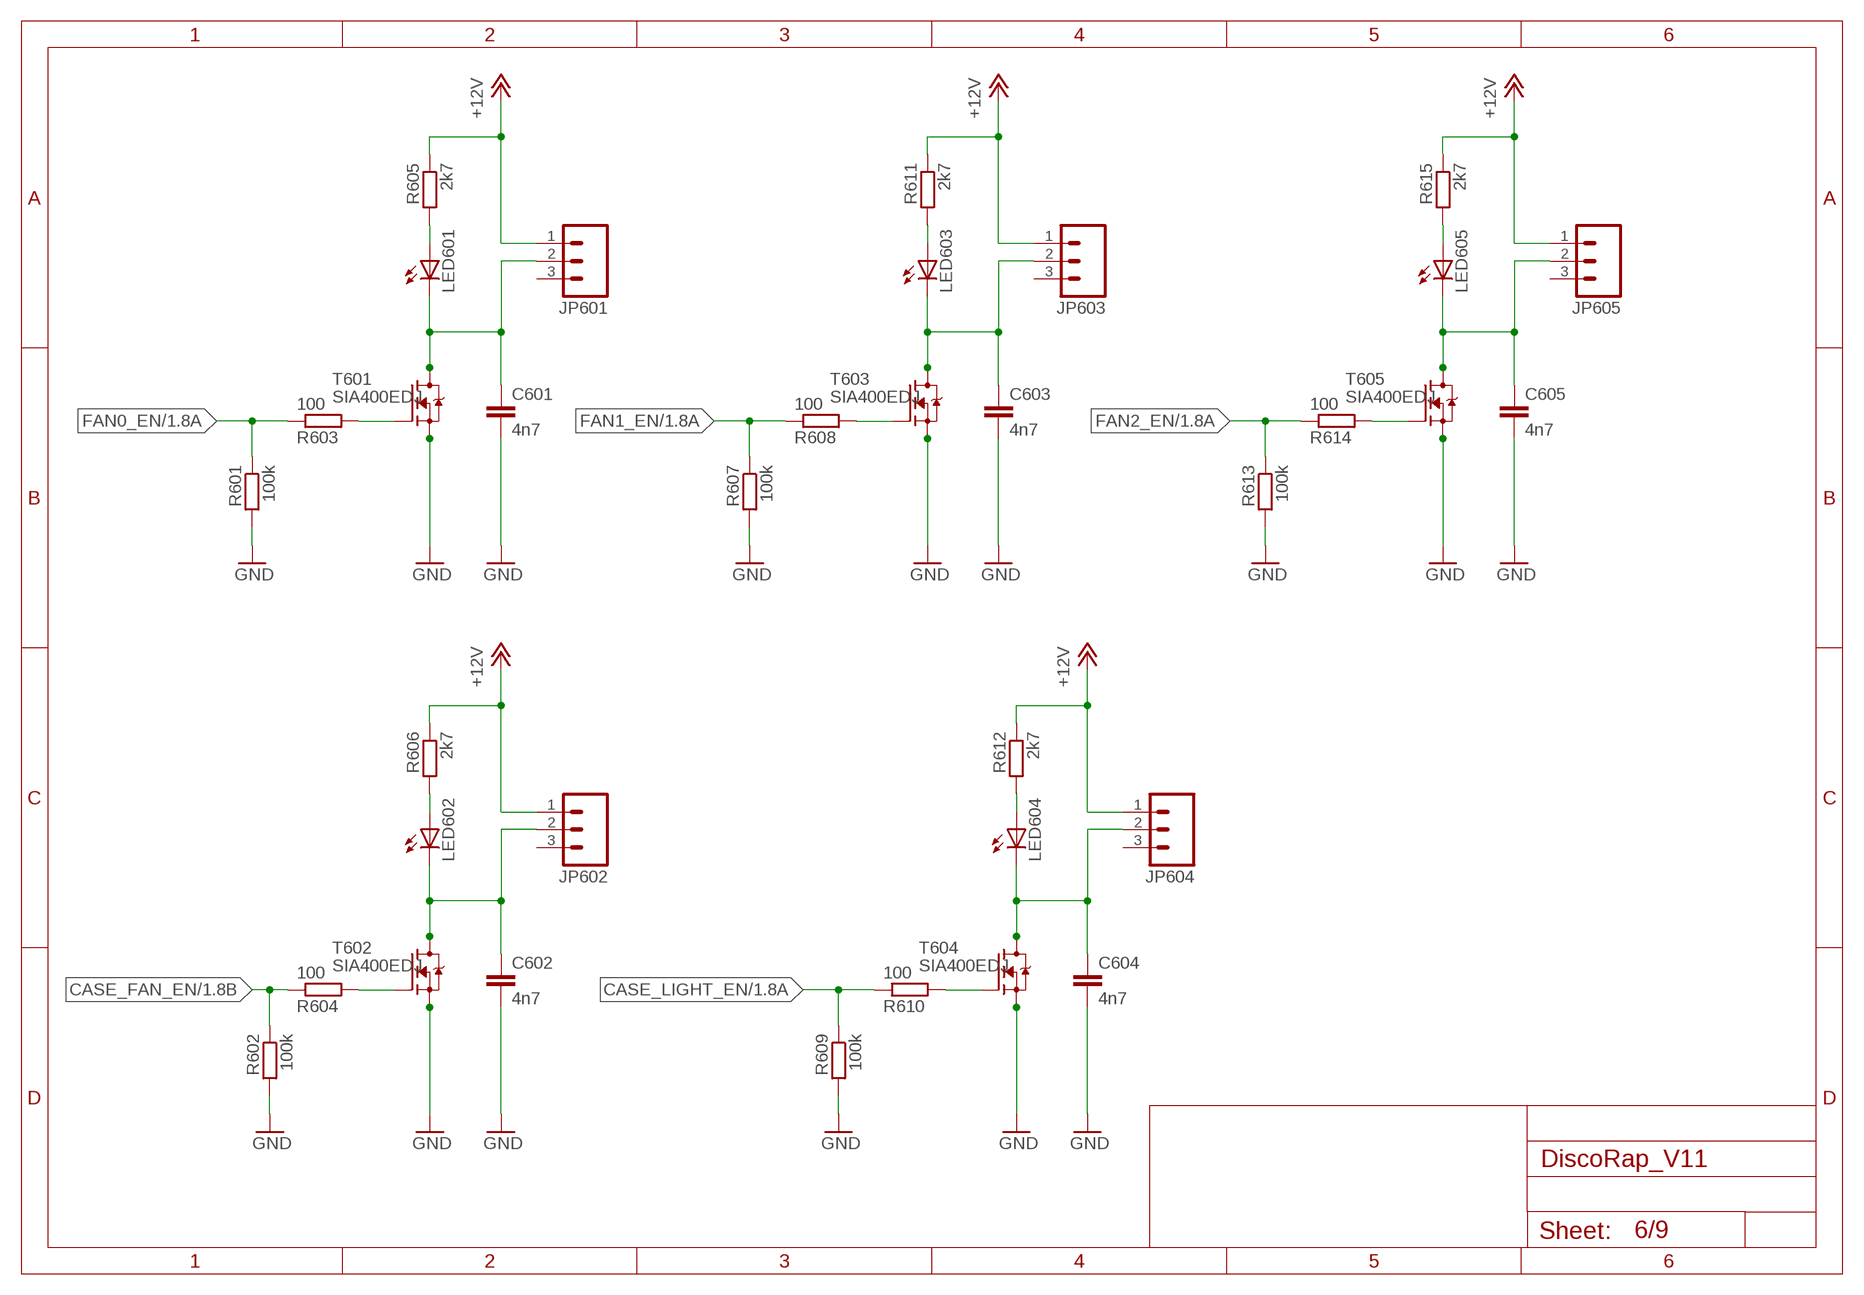
[diagram p5: schematic, sheet 6]

### Parts
C601  4n7  C-EU0805  [0805]
C602  4n7  C-EU0805  [0805]
C603  4n7  C-EU0805  [0805]
C604  4n7  C-EU0805  [0805]
C605  4n7  C-EU0805  [0805]
JP601  M03POLAR  [MOLEX-1X3]
JP602  M03POLAR  [MOLEX-1X3]
JP603  M03POLAR  [MOLEX-1X3]
JP604  M03POLAR  [MOLEX-1X3]
JP605  M03POLAR  [MOLEX-1X3]
LED601  LEDCHIPLED_0805  [CHIPLED_0805]
LED602  LEDCHIPLED_0805  [CHIPLED_0805]
LED603  LEDCHIPLED_0805  [CHIPLED_0805]
LED604  LEDCHIPLED_0805  [CHIPLED_0805]
LED605  LEDCHIPLED_0805  [CHIPLED_0805]
R601  100k  R-EU0805  [0805]
R602  100k  R-EU0805  [0805]
R603  100  R-EU0805  [0805]
R604  100  R-EU0805  [0805]
R605  2k7  R-EU0805  [0805]
R606  2k7  R-EU0805  [0805]
R607  100k  R-EU0805  [0805]
R608  100  R-EU0805  [0805]
R609  100k  R-EU0805  [0805]
R610  100  R-EU0805  [0805]
R611  2k7  R-EU0805  [0805]
R612  2k7  R-EU0805  [0805]
R613  100k  R-EU0805  [0805]
R614  100  R-EU0805  [0805]
R615  2k7  R-EU0805  [0805]
T601  SIA400EDJ  [SC70-6L]
T602  SIA400EDJ  [SC70-6L]
T603  SIA400EDJ  [SC70-6L]
T604  SIA400EDJ  [SC70-6L]
T605  SIA400EDJ  [SC70-6L]

### Nets
+12V: JP601.1 JP602.1 JP603.1 JP604.1 JP605.1 R605.1 R606.1 R611.1 R612.1 R615.1 ; also sheet 4,8
CASE_FAN_EN: R602.1 R604.1 ; also sheet 1
CASE_LIGHT_EN: R609.1 R610.1 ; also sheet 1
FAN0_EN: R601.1 R603.1 ; also sheet 1
FAN1_EN: R607.1 R608.1 ; also sheet 1
FAN2_EN: R613.1 R614.1 ; also sheet 1
GND: C601.2 C602.2 C603.2 C604.2 C605.2 R601.2 R602.2 R607.2 R609.2 R613.2 T601.4(S) T601.EXP_SOURCE(S) T602.4(S) T602.EXP_SOURCE(S) T603.4(S) T603.EXP_SOURCE(S) T604.4(S) T604.EXP_SOURCE(S) T605.4(S) T605.EXP_SOURCE(S) ; also sheet 1,2,3,4,5,7,8,9
N$58: R603.2 T601.3(G)
N$59: C601.1 JP601.2 LED601.C T601.1(D) T601.2(D) T601.5(D) T601.6(D) T601.EXP_DRAIN(D)
N$60: LED601.A R605.2
N$61: R608.2 T603.3(G)
N$62: C603.1 JP603.2 LED603.C T603.1(D) T603.2(D) T603.5(D) T603.6(D) T603.EXP_DRAIN(D)
N$63: LED603.A R611.2
N$64: R614.2 T605.3(G)
N$65: C605.1 JP605.2 LED605.C T605.1(D) T605.2(D) T605.5(D) T605.6(D) T605.EXP_DRAIN(D)
N$66: LED605.A R615.2
N$67: R604.2 T602.3(G)
N$68: C602.1 JP602.2 LED602.C T602.1(D) T602.2(D) T602.5(D) T602.6(D) T602.EXP_DRAIN(D)
N$69: LED602.A R606.2
N$70: R610.2 T604.3(G)
N$71: C604.1 JP604.2 LED604.C T604.1(D) T604.2(D) T604.5(D) T604.6(D) T604.EXP_DRAIN(D)
N$72: LED604.A R612.2
Unconnected: JP601.3 JP602.3 JP603.3 JP604.3 JP605.3

## Sheet 7 of 9
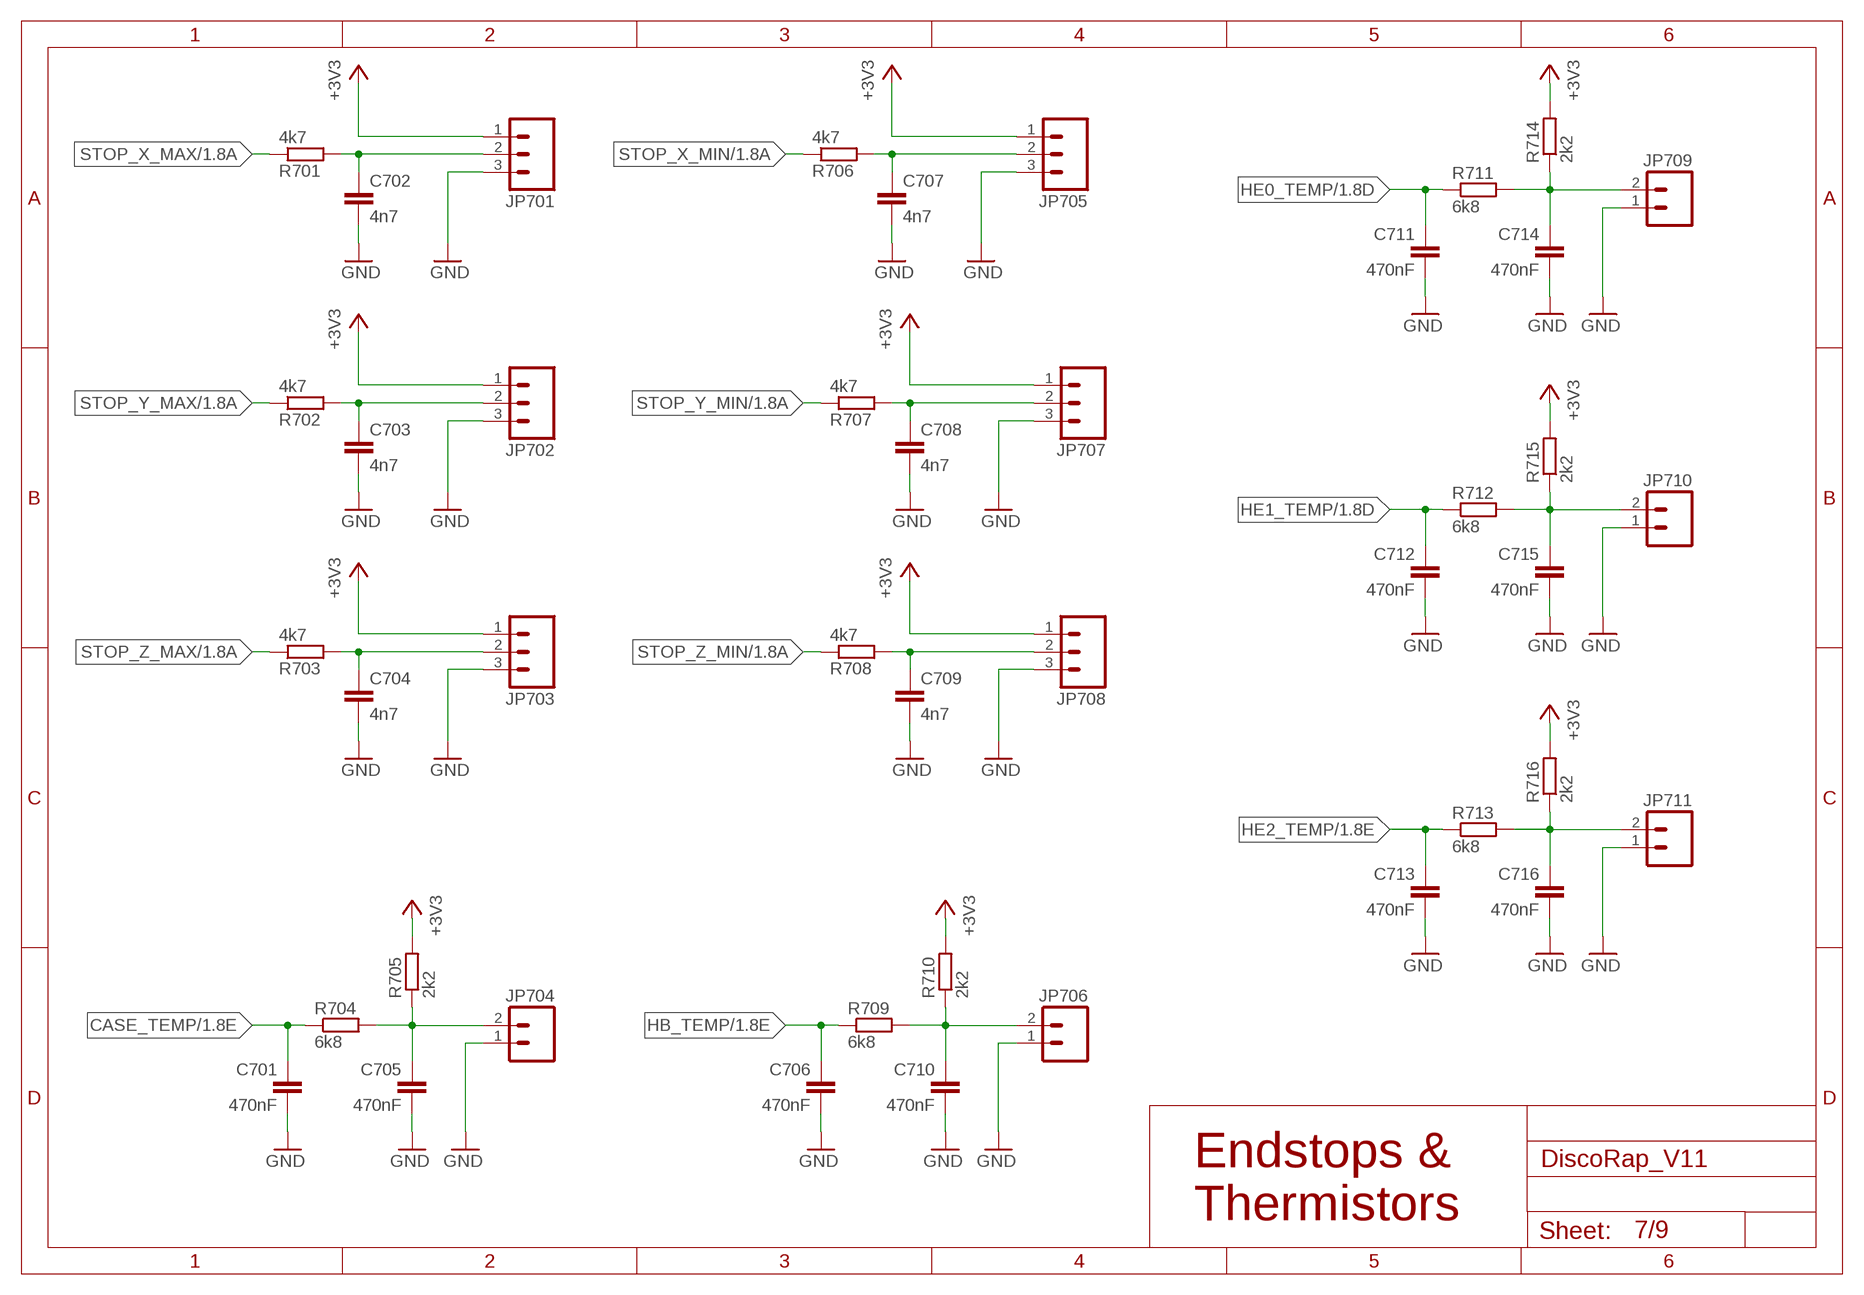
[diagram p6: schematic, sheet 7]

### Parts
C701  470nF  C-EU0805  [0805]
C702  4n7  C-EU0805  [0805]
C703  4n7  C-EU0805  [0805]
C704  4n7  C-EU0805  [0805]
C705  470nF  C-EU0805  [0805]
C706  470nF  C-EU0805  [0805]
C707  4n7  C-EU0805  [0805]
C708  4n7  C-EU0805  [0805]
C709  4n7  C-EU0805  [0805]
C710  470nF  C-EU0805  [0805]
C711  470nF  C-EU0805  [0805]
C712  470nF  C-EU0805  [0805]
C713  470nF  C-EU0805  [0805]
C714  470nF  C-EU0805  [0805]
C715  470nF  C-EU0805  [0805]
C716  470nF  C-EU0805  [0805]
JP701  M03POLAR  [MOLEX-1X3]
JP702  M03POLAR  [MOLEX-1X3]
JP703  M03POLAR  [MOLEX-1X3]
JP704  M02POLAR  [MOLEX-1X2]
JP705  M03POLAR  [MOLEX-1X3]
JP706  M02POLAR  [MOLEX-1X2]
JP707  M03POLAR  [MOLEX-1X3]
JP708  M03POLAR  [MOLEX-1X3]
JP709  M02POLAR  [MOLEX-1X2]
JP710  M02POLAR  [MOLEX-1X2]
JP711  M02POLAR  [MOLEX-1X2]
R701  4k7  R-EU0805  [0805]
R702  4k7  R-EU0805  [0805]
R703  4k7  R-EU0805  [0805]
R704  6k8  R-EU0805  [0805]
R705  2k2  R-EU0805  [0805]
R706  4k7  R-EU0805  [0805]
R707  4k7  R-EU0805  [0805]
R708  4k7  R-EU0805  [0805]
R709  6k8  R-EU0805  [0805]
R710  2k2  R-EU0805  [0805]
R711  6k8  R-EU0805  [0805]
R712  6k8  R-EU0805  [0805]
R713  6k8  R-EU0805  [0805]
R714  2k2  R-EU0805  [0805]
R715  2k2  R-EU0805  [0805]
R716  2k2  R-EU0805  [0805]

### Nets
+3V3: JP701.1 JP702.1 JP703.1 JP705.1 JP707.1 JP708.1 R705.2 R710.2 R714.2 R715.2 R716.2 ; also sheet 1,2,3,8,9
CASE_TEMP: C701.1 R704.1 ; also sheet 1
GND: C701.2 C702.2 C703.2 C704.2 C705.2 C706.2 C707.2 C708.2 C709.2 C710.2 C711.2 C712.2 C713.2 C714.2 C715.2 C716.2 JP701.3 JP702.3 JP703.3 JP704.1 JP705.3 JP706.1 JP707.3 JP708.3 JP709.1 JP710.1 JP711.1 ; also sheet 1,2,3,4,5,6,8,9
HB_TEMP: C706.1 R709.1 ; also sheet 1
HE0_TEMP: C711.1 R711.1 ; also sheet 1
HE1_TEMP: C712.1 R712.1 ; also sheet 1
HE2_TEMP: C713.1 R713.1 ; also sheet 1
N$73: C702.1 JP701.2 R701.2
N$74: C703.1 JP702.2 R702.2
N$75: C704.1 JP703.2 R703.2
N$76: C709.1 JP708.2 R708.2
N$77: C708.1 JP707.2 R707.2
N$78: C707.1 JP705.2 R706.2
N$79: C710.1 JP706.2 R709.2 R710.1
N$80: C714.1 JP709.2 R711.2 R714.1
N$81: C715.1 JP710.2 R712.2 R715.1
N$82: C716.1 JP711.2 R713.2 R716.1
N$83: C705.1 JP704.2 R704.2 R705.1
STOP_X_MAX: R701.1 ; also sheet 1
STOP_X_MIN: R706.1 ; also sheet 1
STOP_Y_MAX: R702.1 ; also sheet 1
STOP_Y_MIN: R707.1 ; also sheet 1
STOP_Z_MAX: R703.1 ; also sheet 1
STOP_Z_MIN: R708.1 ; also sheet 1

### Notes on the sheet
- Endstops &
  Thermistors

## Sheet 8 of 9
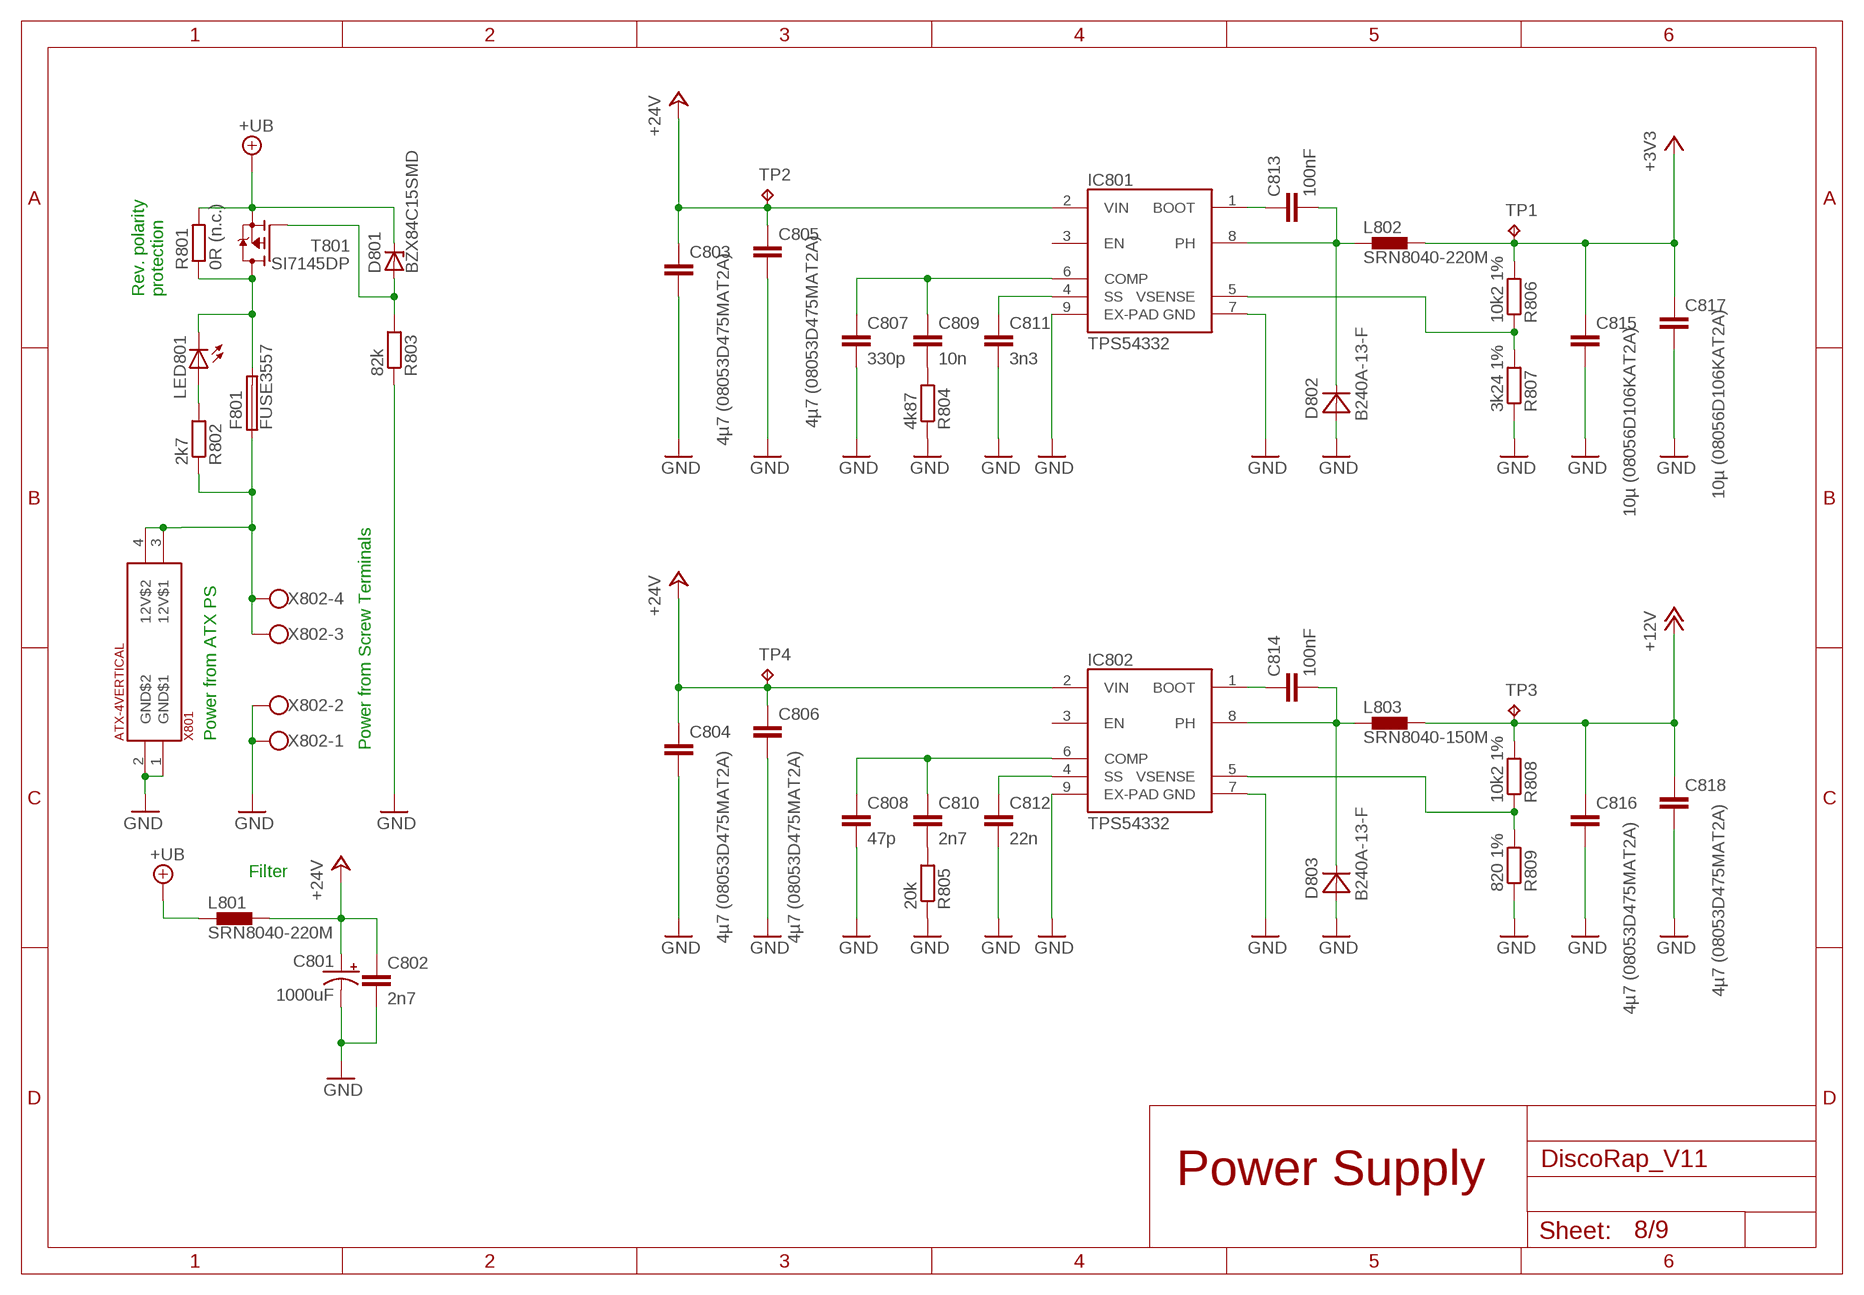
[diagram p7: schematic, sheet 8]

### Parts
C801  1000uF  CAP_POLPTH4  [CPOL-RADIAL-1000UF-25V]
C802  2n7  C-EU0805  [0805]
C803  4µ7 (08053D475MAT2A)  C-EU0805  [0805]
C804  4µ7 (08053D475MAT2A)  C-EU0805  [0805]
C805  4µ7 (08053D475MAT2A)  C-EU0805  [0805]
C806  4µ7 (08053D475MAT2A)  C-EU0805  [0805]
C807  330p  C-EU0805  [0805]
C808  47p  C-EU0805  [0805]
C809  10n  C-EU0805  [0805]
C810  2n7  C-EU0805  [0805]
C811  3n3  C-EU0805  [0805]
C812  22n  C-EU0805  [0805]
C813  100nF  C-EU0805  [0805]
C814  100nF  C-EU0805  [0805]
C815  10µ (08056D106KAT2A)  C-EU0805  [0805]
C816  4µ7 (08053D475MAT2A)  C-EU0805  [0805]
C817  10µ (08056D106KAT2A)  C-EU0805  [0805]
C818  4µ7 (08053D475MAT2A)  C-EU0805  [0805]
D801  BZX84C15SMD  BZX84CSMD  [TO236]
D802  B240A-13-F  MBRA340T3  [SMA]
D803  B240A-13-F  MBRA340T3  [SMA]
F801  FUSE3557  [3557]
IC801  TPS54332  [PDSO-G8]
IC802  TPS54332  [PDSO-G8]
L801  SRN8040-220M  SRN8040  [SRN8040]
L802  SRN8040-220M  SRN8040  [SRN8040]
L803  SRN8040-150M  SRN8040  [SRN8040]
LED801  LEDCHIPLED_0805  [CHIPLED_0805]
R801  0R (n.c.)  R-EU_R2512  [R2512]
R802  2k7  R-EU0805  [0805]
R803  82k  R-EU0805  [0805]
R804  4k87  R-EU0805  [0805]
R805  20k  R-EU0805  [0805]
R806  10k2 1%  R-EU0805  [0805]
R807  3k24 1%  R-EU0805  [0805]
R808  10k2 1%  R-EU0805  [0805]
R809  820 1%  R-EU0805  [0805]
T801  SI7145DP  [SO-8_POWERPACK]
TP1  TPB1,27  [B1,27]
TP2  TPB1,27  [B1,27]
TP3  TPB1,27  [B1,27]
TP4  TPB1,27  [B1,27]
X801  ATX-4VERTICAL  [MINIFITJR-4-VERTICAL]
X802  W237-4  [W237-4]

### Nets
+3V3: C815.1 C817.1 L802.2 R806.2 TP1.TP ; also sheet 1,2,3,7,9
+12V: C816.1 C818.1 L803.2 R808.2 TP3.TP ; also sheet 4,6
+24V: C801.1(+) C802.1 C803.1 C804.1 C805.1 C806.1 IC801.2(VIN) IC802.2(VIN) L801.2 TP2.TP TP4.TP
+UB: D801.C L801.1 R801.2 T801.1(S) T801.2(S) T801.3(S) ; also sheet 2,3,4,5
GND: C801.2(-) C802.2 C803.2 C804.2 C805.2 C806.2 C807.2 C808.2 C811.2 C812.2 C815.2 C816.2 C817.2 C818.2 D802.A D803.A IC801.7(GND) IC801.9(EX-PAD) IC802.7(GND) IC802.9(EX-PAD) R803.1 R804.1 R805.1 R807.1 R809.1 X801.1(GND$1) X801.2(GND$2) X802.1 X802.2 ; also sheet 1,2,3,4,5,6,7,9
N$3: C809.2 R804.2
N$4: C811.1 IC801.4(SS)
N$5: C813.1 IC801.1(BOOT)
N$7: C814.2 D803.C IC802.8(PH) L803.1
N$8: IC802.5(VSENSE) R808.1 R809.2
N$9: C808.1 C810.1 IC802.6(COMP)
N$10: C810.2 R805.2
N$11: C812.1 IC802.4(SS)
N$12: C814.1 IC802.1(BOOT)
N$45: C813.2 D802.C IC801.8(PH) L802.1
N$46: IC801.5(VSENSE) R806.1 R807.2
N$47: C807.1 C809.1 IC801.6(COMP)
N$84: D801.A R803.2 T801.4(G)
N$85: F801.1 F801.2 R802.1 X801.3(12V$1) X801.4(12V$2) X802.3 X802.4
N$86: F801.3 F801.4 LED801.C R801.1 T801.5(D) T801.6(D) T801.7(D) T801.8(D) T801.EXP_PAD(D)
N$87: LED801.A R802.2
Unconnected: IC801.3(EN) IC802.3(EN)

### Notes on the sheet
- Rev. polarity
  protection
- Power from Screw Terminals
- Power from ATX PS
- Filter
- Power Supply

## Sheet 9 of 9
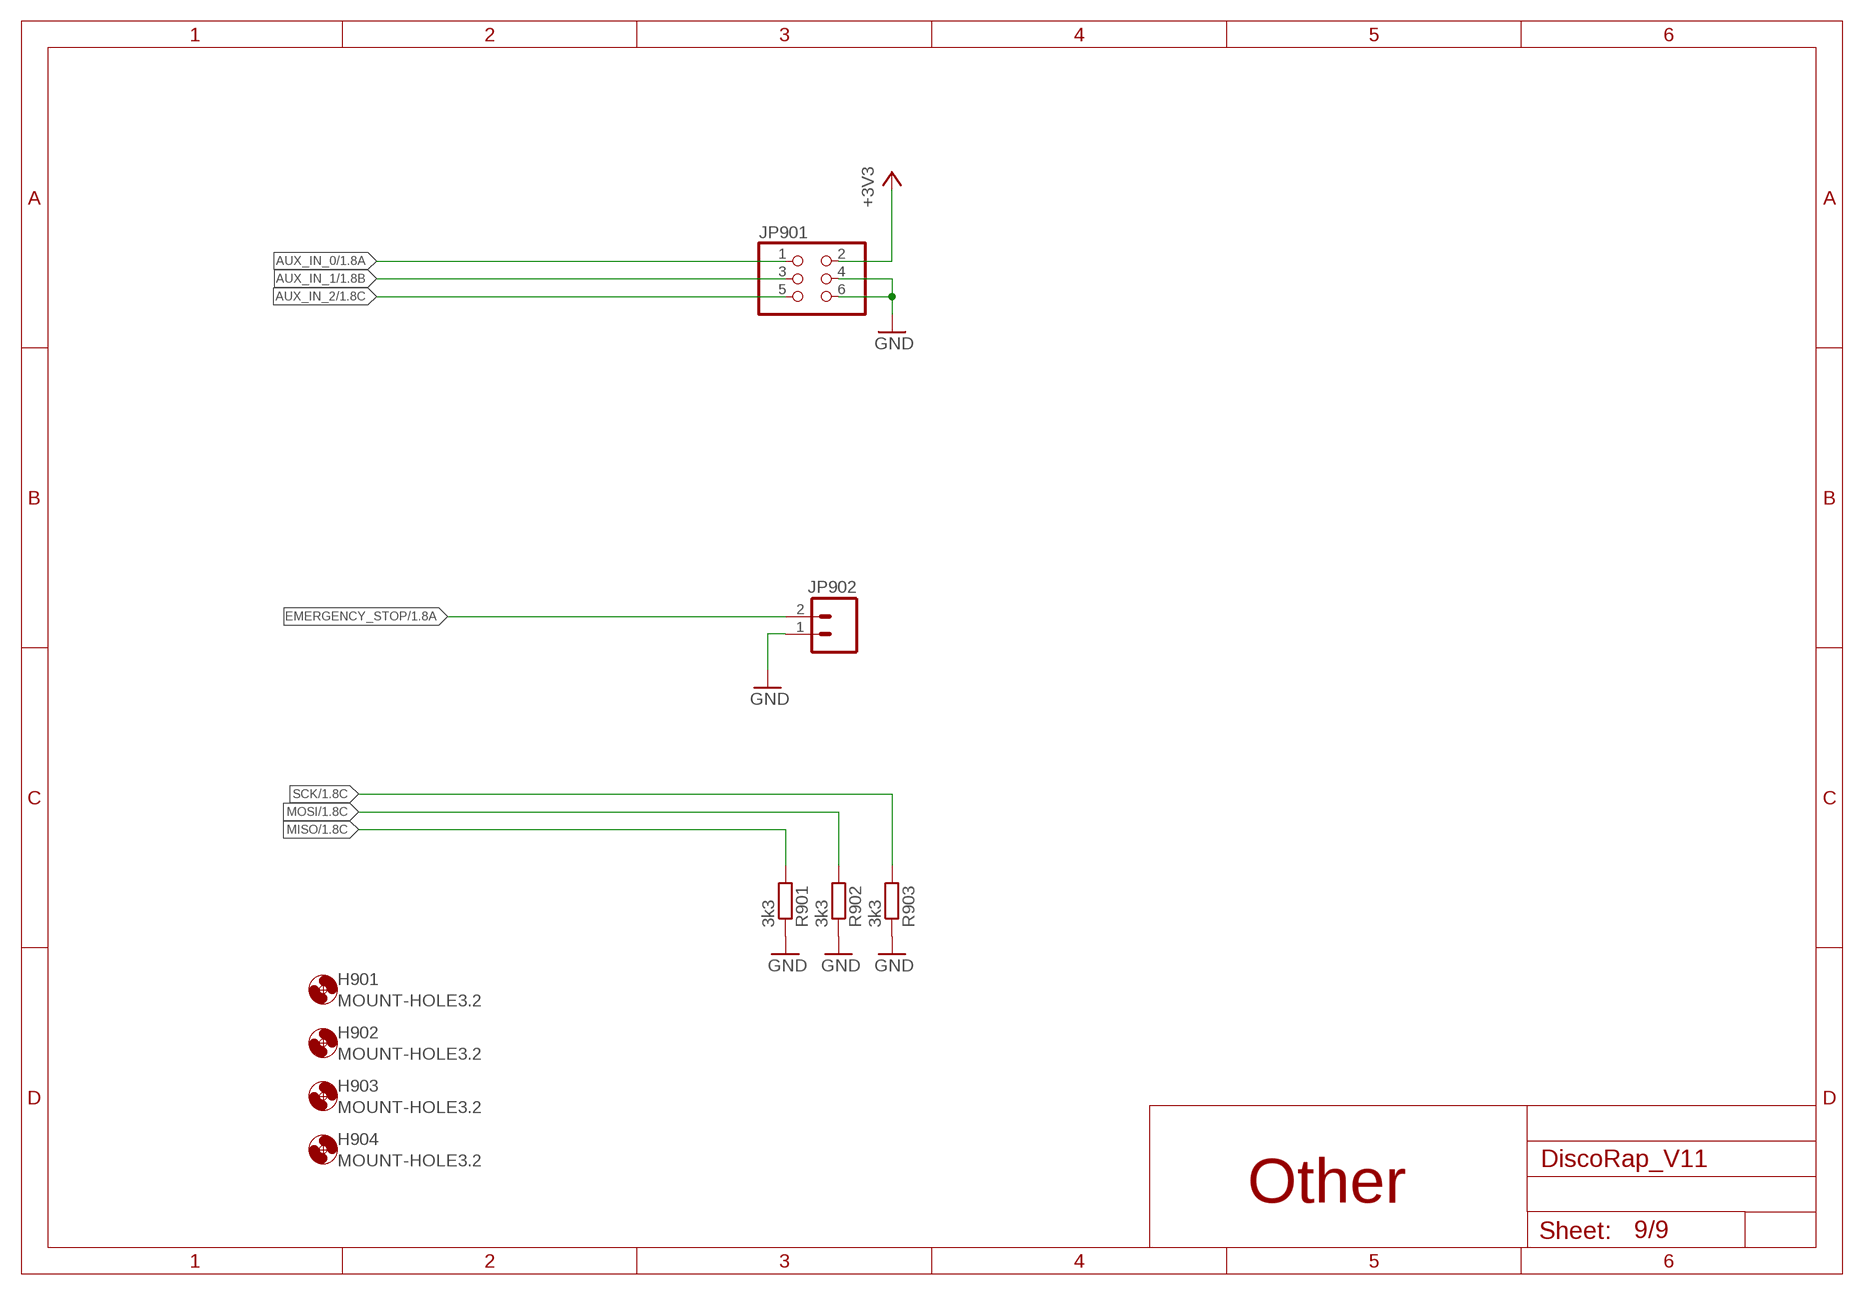
[diagram p8: schematic, sheet 9]

### Parts
H901  MOUNT-HOLE3.2  [3,2]
H902  MOUNT-HOLE3.2  [3,2]
H903  MOUNT-HOLE3.2  [3,2]
H904  MOUNT-HOLE3.2  [3,2]
JP901  PINHD-2X3  [2X03]
JP902  M02POLAR  [MOLEX-1X2]
R901  3k3  R-EU0805  [0805]
R902  3k3  R-EU0805  [0805]
R903  3k3  R-EU0805  [0805]

### Nets
+3V3: JP901.2 ; also sheet 1,2,3,7,8
AUX_IN_0: JP901.1 ; also sheet 1
AUX_IN_1: JP901.3 ; also sheet 1
AUX_IN_2: JP901.5 ; also sheet 1
EMERGENCY_STOP: JP902.2 ; also sheet 1
GND: JP901.4 JP901.6 JP902.1 R901.1 R902.1 R903.1 ; also sheet 1,2,3,4,5,6,7,8
MISO: R901.2 ; also sheet 1,2,3
MOSI: R902.2 ; also sheet 1,2,3
SCK: R903.2 ; also sheet 1,2,3

### Notes on the sheet
- Other

## Library data of the parts
BUZ1 = buzzer:F/CM12P: BUZZER Source: Buerklin
C101-C104 C201-C216 C219 C220 C223-C230 C232 C301-C316 C319 C320 C323-C330 C332 C401-C403 C501-C503 C601-C605 C701-C716 C802-C818 = bluetooth:C-EU
C217 C218 C221 C222 C231 C233 C317 C318 C321 C322 C331 C333 = rcl:CPOL-EU: POLARIZED CAPACITOR, European symbol
C801 = SparkFun:CAP_POL: Capacitor Polarized These are standard SMD and PTH capacitors. Normally 10uF, 47uF, and 100uF in electrolytic and tantalum varieties. Always verify the external diameter of the through hole cap, it varies with capacity, voltage, and manufacturer. The EIA devices should be standard.
D401 D501-D503 = diode:CGRM400*-G: Molded plasitc,JEDEC SOD-123/Mini SMA Source: Comchip CGRM4001-G.pdf
D801 = diode:BZX84CSMD: Z DIODE
D802 D803 = diode:MBRA340T3: Surface Mount Schottky Power Rectifier Source: http://www.onsemi.com/pub_link/Collateral/MBRA340T3-D.PDF
F501 F801 = fuse:FUSE: Fuse
H901-H904 = holes:MOUNT-HOLE: MOUNTING HOLE with drill center marker
IC101 = DiscoRap:DG2722: Vishay 2 Port, USB 2.0 High Speed (480 Mbps) Switch, DPDT Analog Switch
IC102 = microchip:24*00: Serial EEPROM 128 bit, I2C (AA = 1.8 V/LC = 2.5 V/C = 5.0 V); MF: MICROCHIP; MPN: 24LC00T-I/OT; OC_FARNELL: 9757864; OC_NEWARK: 62K0574
IC103 IC104 = microchip:MCP23S17: http://ww1.microchip.com/downloads/en/DeviceDoc/21952a.pdf Source: http://ww1.microchip.com/downloads/en/DeviceDoc/21952a.pdf; MF: MICROCHIP; MPN: MCP23S17-E/SO; OC_FARNELL: unknown; OC_NEWARK: 31K2950
IC201-IC203 IC301-IC303 = DiscoRap:TMC260: TRINAMIC TMC260/261 Universal, cost-effective stepper drivers for two-phase bipolar motors with state-of-the-art features. Integrated MOSFETs for up to 2 A motor currents per coil. With Step/Dir Interface and SPI.
IC401 = microchip-6:MCP1402: MOSFET driver
IC801 IC802 = DiscoRap:TPS54332: TPS54332 3.5V to 28V Input, 3.5A, 1MHz Step-Down Converter with Eco-mode
JP101 JP102 = pinhead:PINHD-1X2: PIN HEADER
JP103 = pinhead:PINHD-2X5: PIN HEADER
JP601-JP605 JP701-JP703 JP705 JP707 JP708 = SparkFun:M03: Header 3 Standard 3-pin 0.1" header. Use with straight break away headers (SKU : PRT-00116), right angle break away headers (PRT-00553), swiss pins (PRT-00743), machine pins (PRT-00117), and female headers (PRT-00115). Molex polarized connector foot print use with SKU : PRT-08232 with associated crimp pins and housings.
JP704 JP706 JP709-JP711 JP902 = SparkFun:M02: Header 2 Standard 2-pin 0.1" header. Use with straight break away headers (SKU : PRT-00116), right angle break away headers (PRT-00553), swiss pins (PRT-00743), machine pins (PRT-00117), and female headers (PRT-00115). Molex polarized connector foot print use with SKU : PRT-08233 with associated crimp pins and housings.
JP901 = pinhead:PINHD-2X3: PIN HEADER
L801-L803 = DiscoRap:SRN8040: Bourns SRN8040 Series - Semi-shielded Power Inductors
LED401 LED501-LED504 LED601-LED605 LED801 = led:LED: LED OSRAM: - CHIPLED LG R971, LG N971, LY N971, LG Q971, LY Q971, LO R971, LY R971 LH N974, LH R974 LS Q976, LO Q976, LY Q976 LO Q996 - Hyper CHIPLED LW Q18S LB Q993, LB Q99A, LB R99A - SideLED LS A670, LO A670, LY A670, LG A670, LP A670 LB A673, LV A673, LT A673, LW A673 LH A674 LY A675 LS A676, LA A676, LO A676, LY A676, LW A676 LS A679, LY A679, LG A679 - Hyper Micro SIDELED® LS Y876, LA Y876, LO Y876, LY Y876 LT Y87S - SmartLED LW L88C, LW L88S LB L89C, LB L89S, LG L890 LS L89K, LO L89K, LY L89K LS L896, LA L896, LO L896, LY L896 - TOPLED LS T670, LO T670, LY T670, LG T670, LP T670 LSG T670, LSP T670, LSY T670, LOP T670, LYG T670 LG T671, LOG T671, LSG T671 LB T673, LV T673, LT T673, LW T673 LH T674 LS T676, LA T676, LO T676, LY T676, LB T676, LH T676, LSB T676, LW T676 LB T67C, LV T67C, LT T67C, LS T67K, LO T67K, LY T67K, LW E67C LS E67B, LA E67B, LO E67B, LY E67B, LB E67C, LV E67C, LT E67C LW T67C LS T679, LY T679, LG T679 LS T770, LO T770, LY T770, LG T770, LP T770 LB T773, LV T773, LT T773, LW T773 LH T774 LS E675, LA E675, LY E675, LS T675 LS T776, LA T776, LO T776, LY T776, LB T776 LHGB T686 LT T68C, LB T68C - Hyper Mini TOPLED® LB M676 - Mini TOPLED Santana® LG M470 LS M47K, LO M47K, LY M47K Source: http://www.osram.convergy.de LUXEON: - LUMILED® LXK2-PW12-R00, LXK2-PW12-S00, LXK2-PW14-U00, LXK2-PW14-V00 LXK2-PM12-R00, LXK2-PM12-S00, LXK2-PM14-U00 LXK2-PE12-Q00, LXK2-PE12-R00, LXK2-PE12-S00, LXK2-PE14-T00, LXK2-PE14-U00 LXK2-PB12-K00, LXK2-PB12-L00, LXK2-PB12-M00, LXK2-PB14-N00, LXK2-PB14-P00, LXK2-PB14-Q00 LXK2-PR12-L00, LXK2-PR12-M00, LXK2-PR14-Q00, LXK2-PR14-R00 LXK2-PD12-Q00, LXK2-PD12-R00, LXK2-PD12-S00 LXK2-PH12-R00, LXK2-PH12-S00 LXK2-PL12-P00, LXK2-PL12-Q00, LXK2-PL12-R00 Source: www.luxeon.com KINGBRIGHT: KA-3528ASYC Source: www.kingbright.com
Q101 Q102 = transistor-npn:BC817*: NPN Transistor
R101-R107 R401-R403 R501-R510 R601-R615 R701-R716 R802-R809 R901-R903 = bluetooth:R-EU
R201-R206 R301-R306 R801 = rcl:R-EU_: RESISTOR, European symbol
T401 = DiscoRap:SIR416DP: Vishay Siliconix N-Channel 40V MOSFET Rds-On: 4.2mOhm @ 4.5V
T501-T503 T601-T605 = DiscoRap:SIA400EDJ: Vishay Siliconix SiA400EDJ N-Channel 30V MOSFET Rds-on: 0.025 @ 2.5V
T801 = DiscoRap:SI7145DP: Vishay Siloconix Si7145DP P-Channel 30V MOSFET Rds-On: 3.75mOhm @ -4.5V
TP1-TP4 = testpad:TP: Test pad
X101 = DiscoRap:USB-B_SMD
X102 = DiscoRap:TE_292303-9: TE Connectivity USB-A TE No. 292303-9
X103 = DiscoRap:AMP_1010070864: Amphenol SD-Card Connector 1010070864
X104 = DiscoRap:STM32F429_DISCO: STM32F429 Discovery Board
X201-X203 X301-X303 X401 X802 = con-wago-500:W237-4: WAGO SCREW CLAMP
X501-X503 = con-wago-500:W237-102: WAGO SCREW CLAMP; MPN: 237-102; OC_FARNELL: unknown; OC_NEWARK: 70K9898
X801 = atx-power-supply:ATX-4